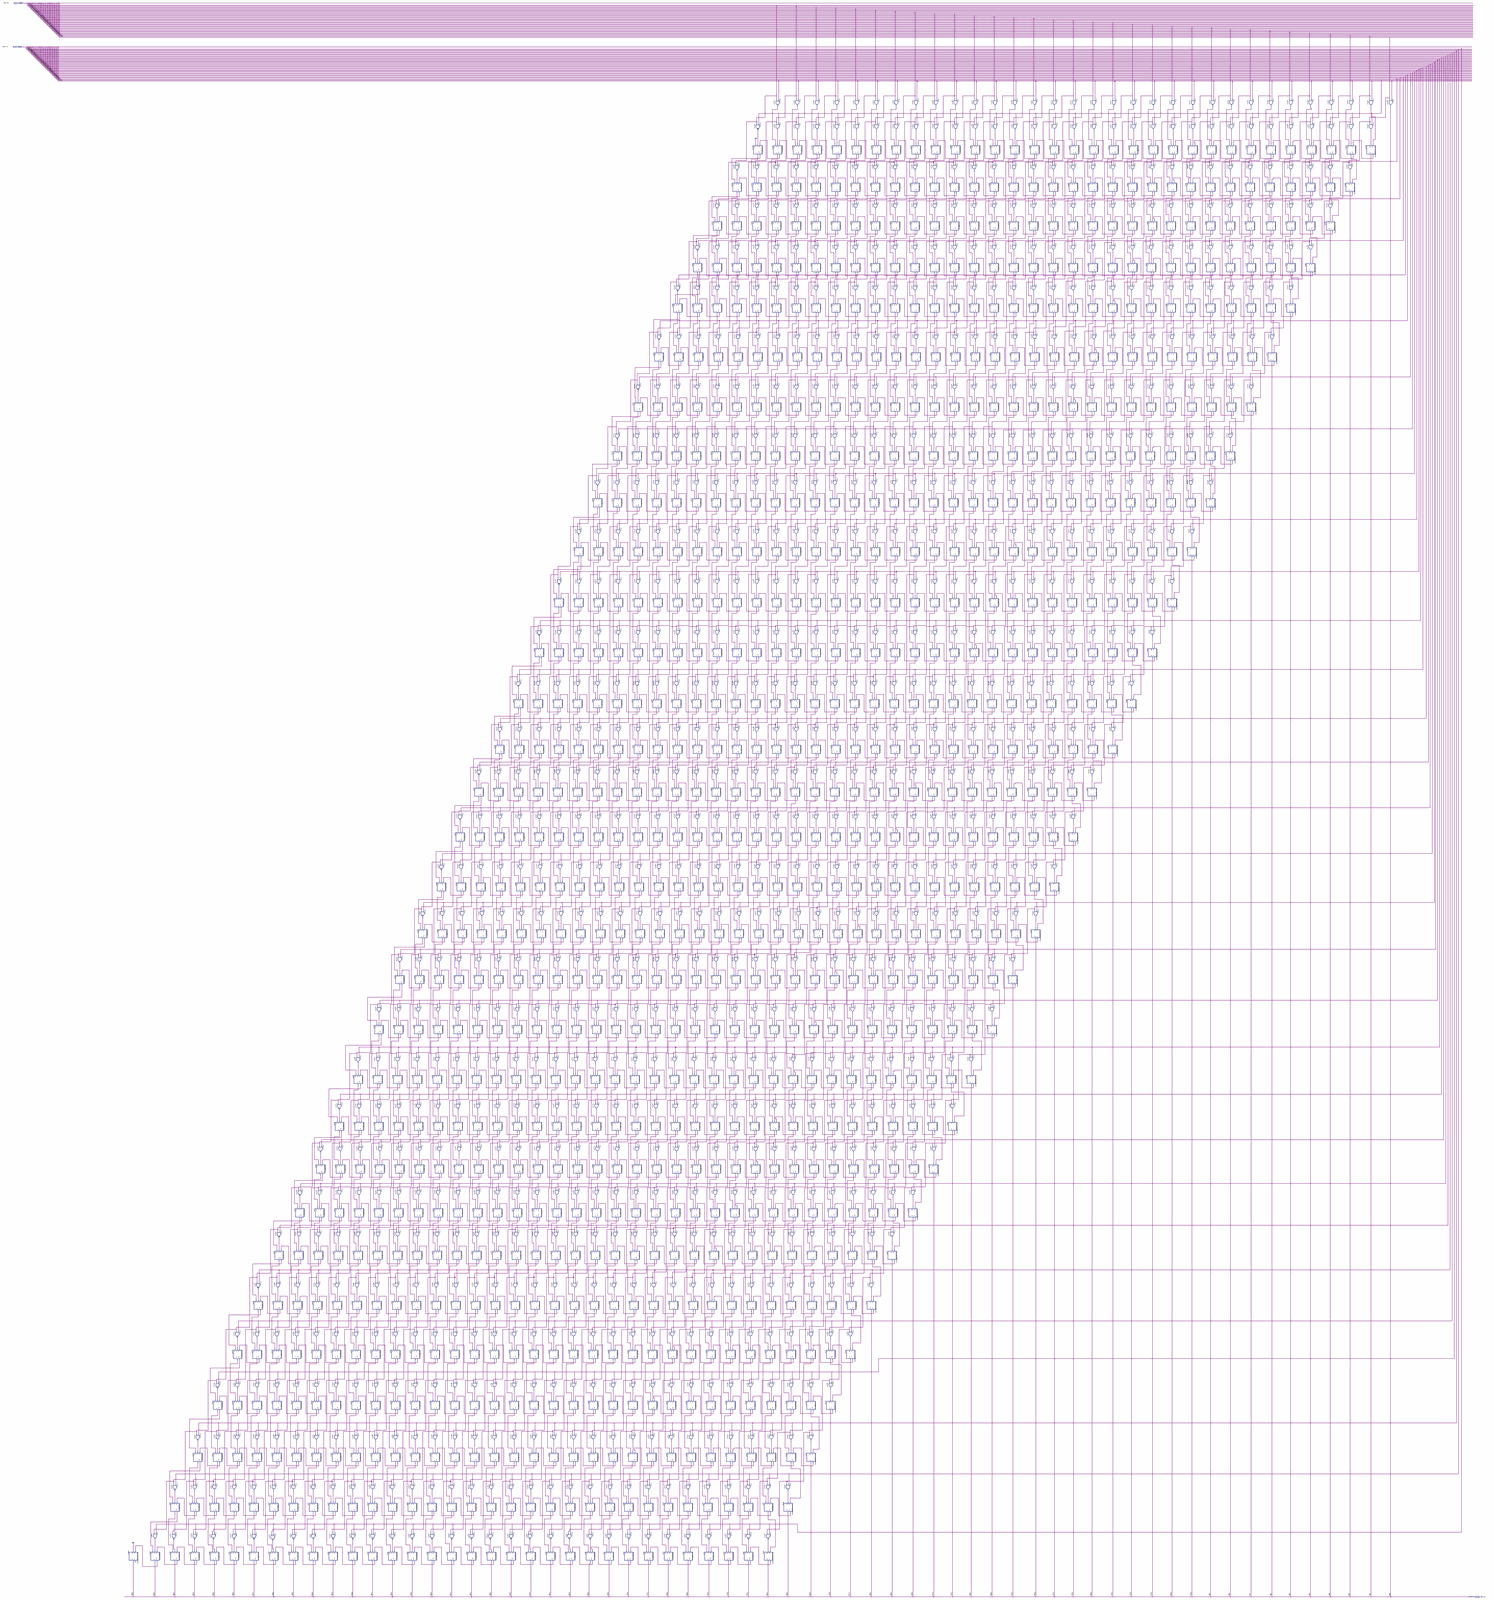
[diagram p0: schematic sheet, whole]
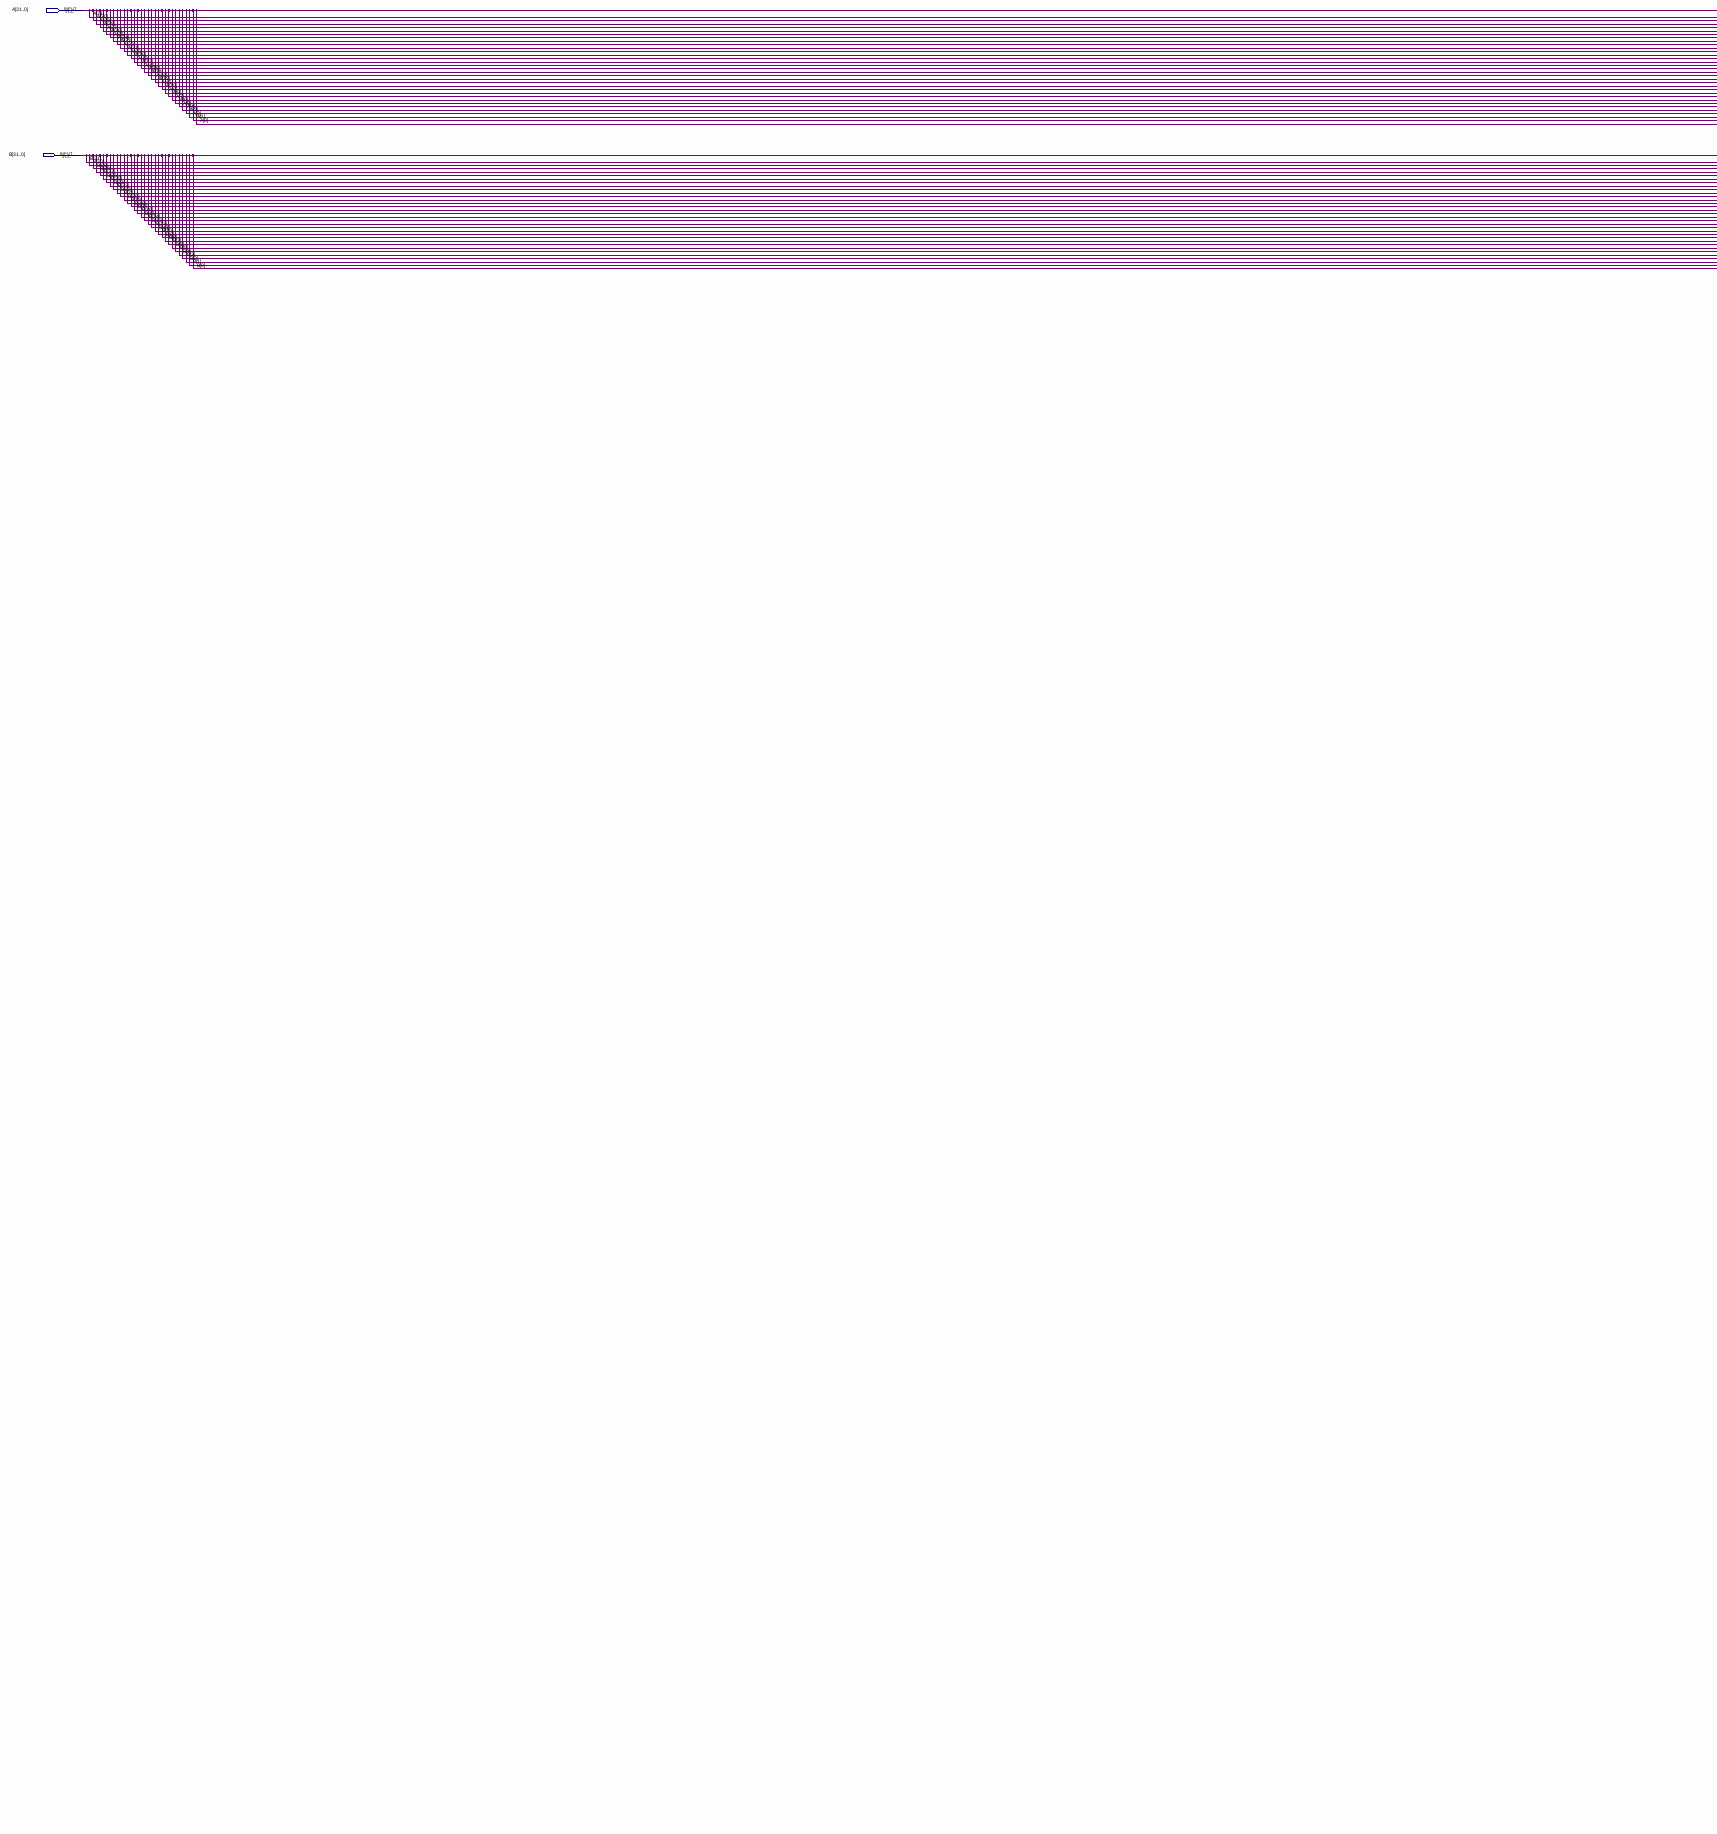
[diagram p1: schematic sheet, upper left part]
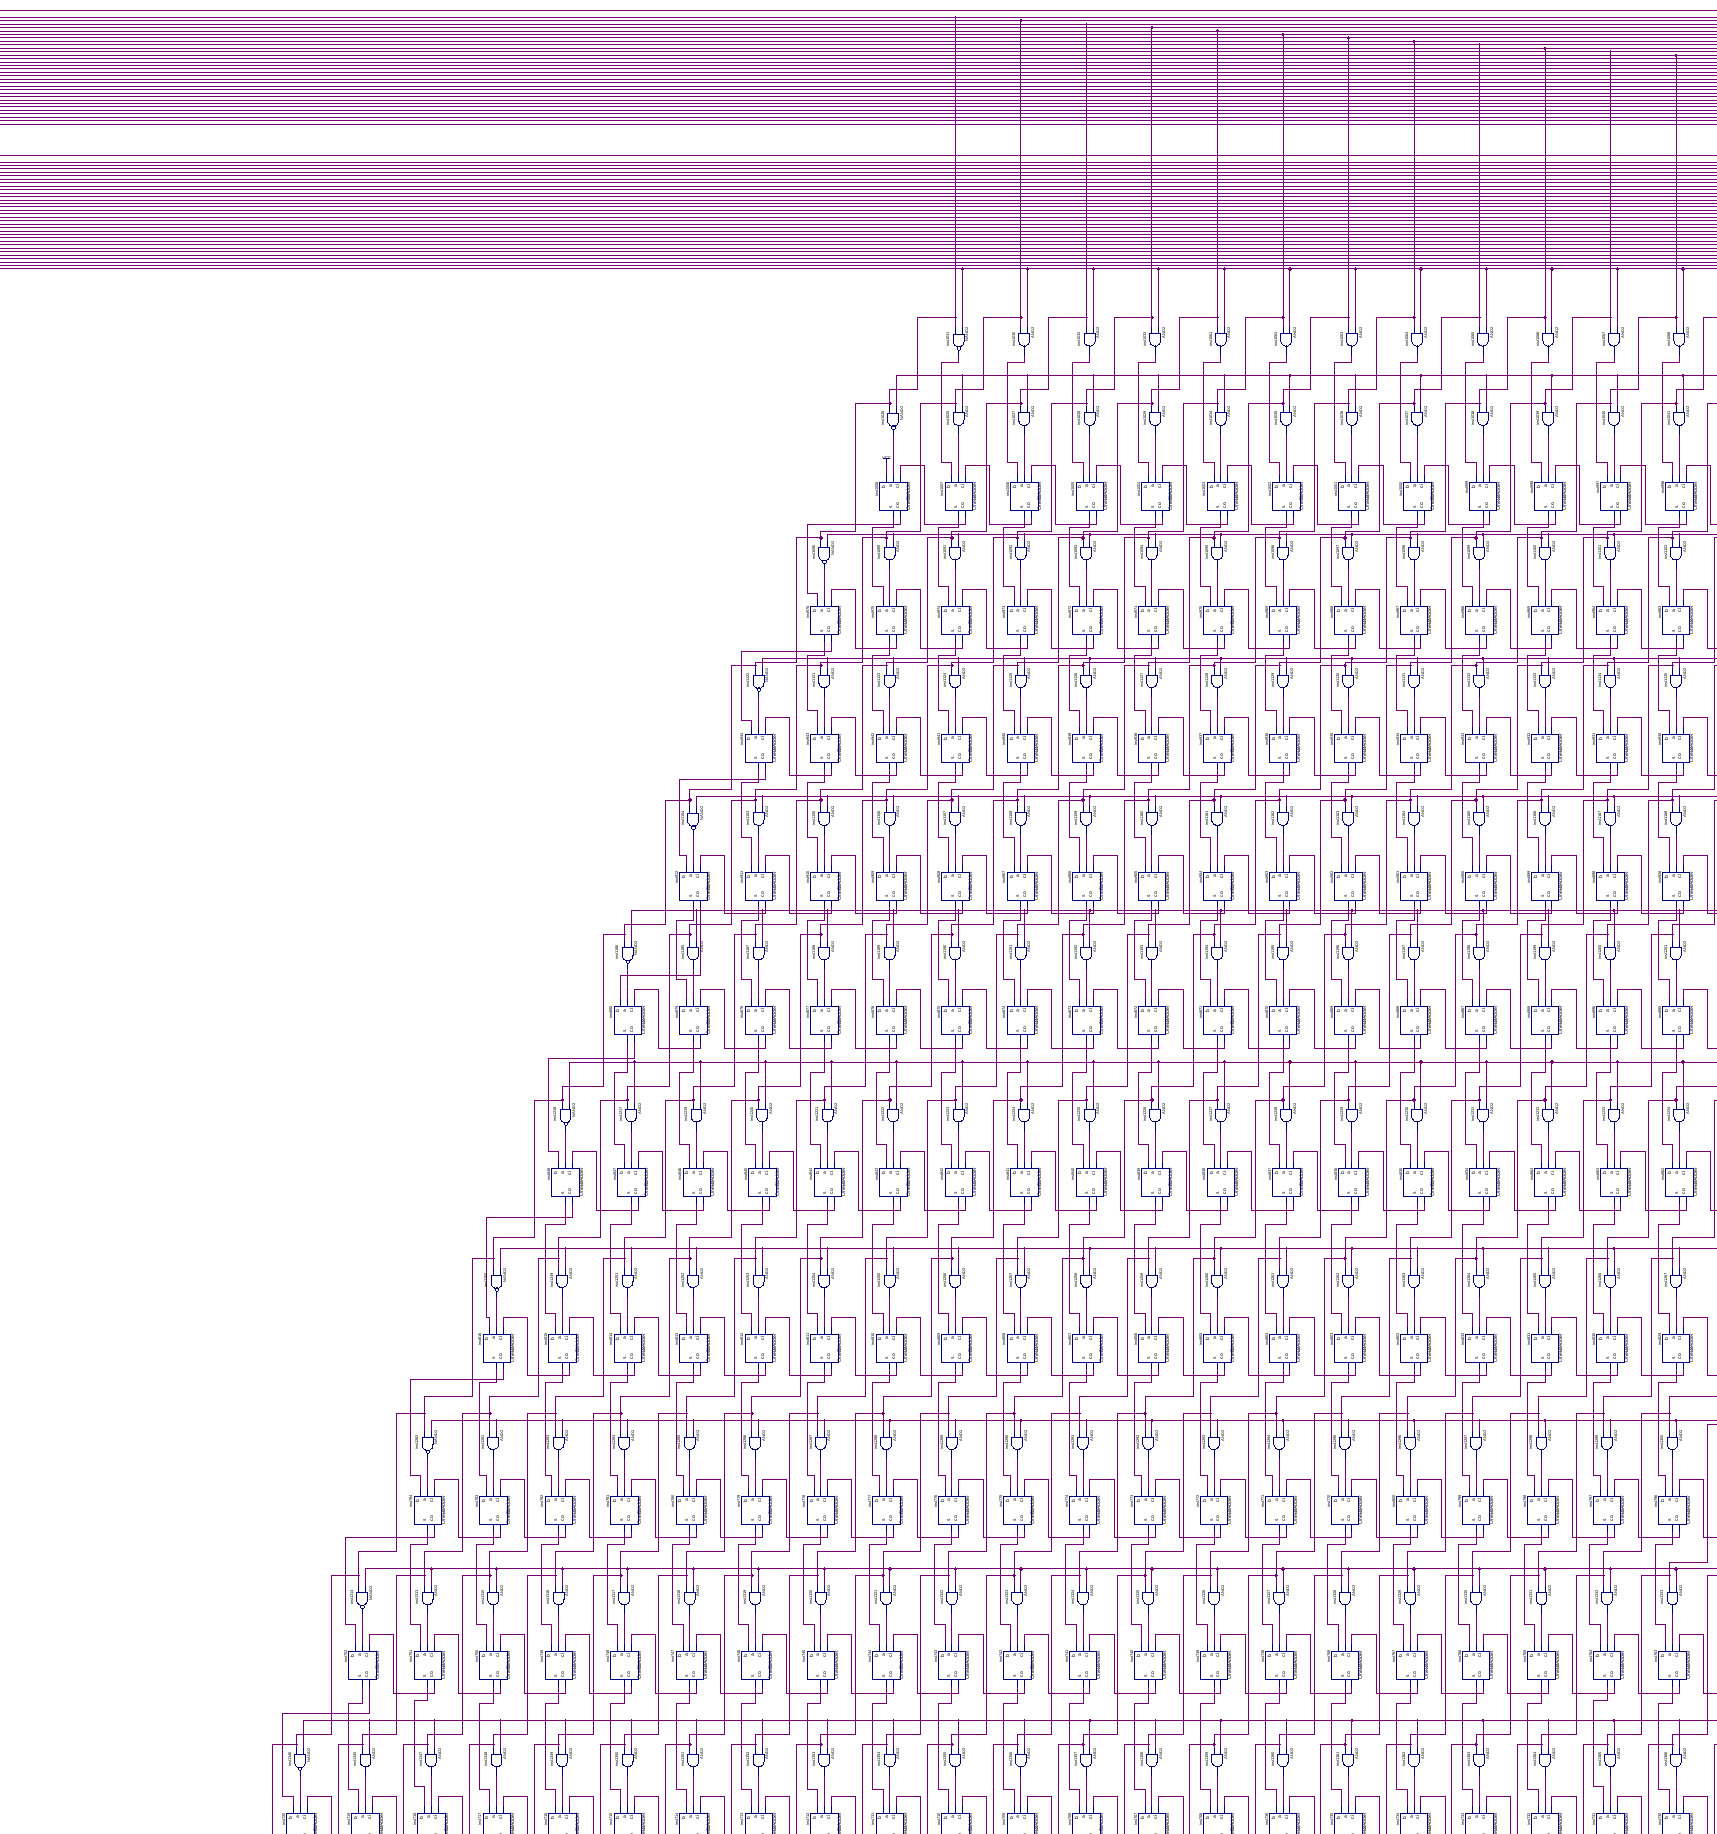
[diagram p2: schematic sheet, upper centre part]
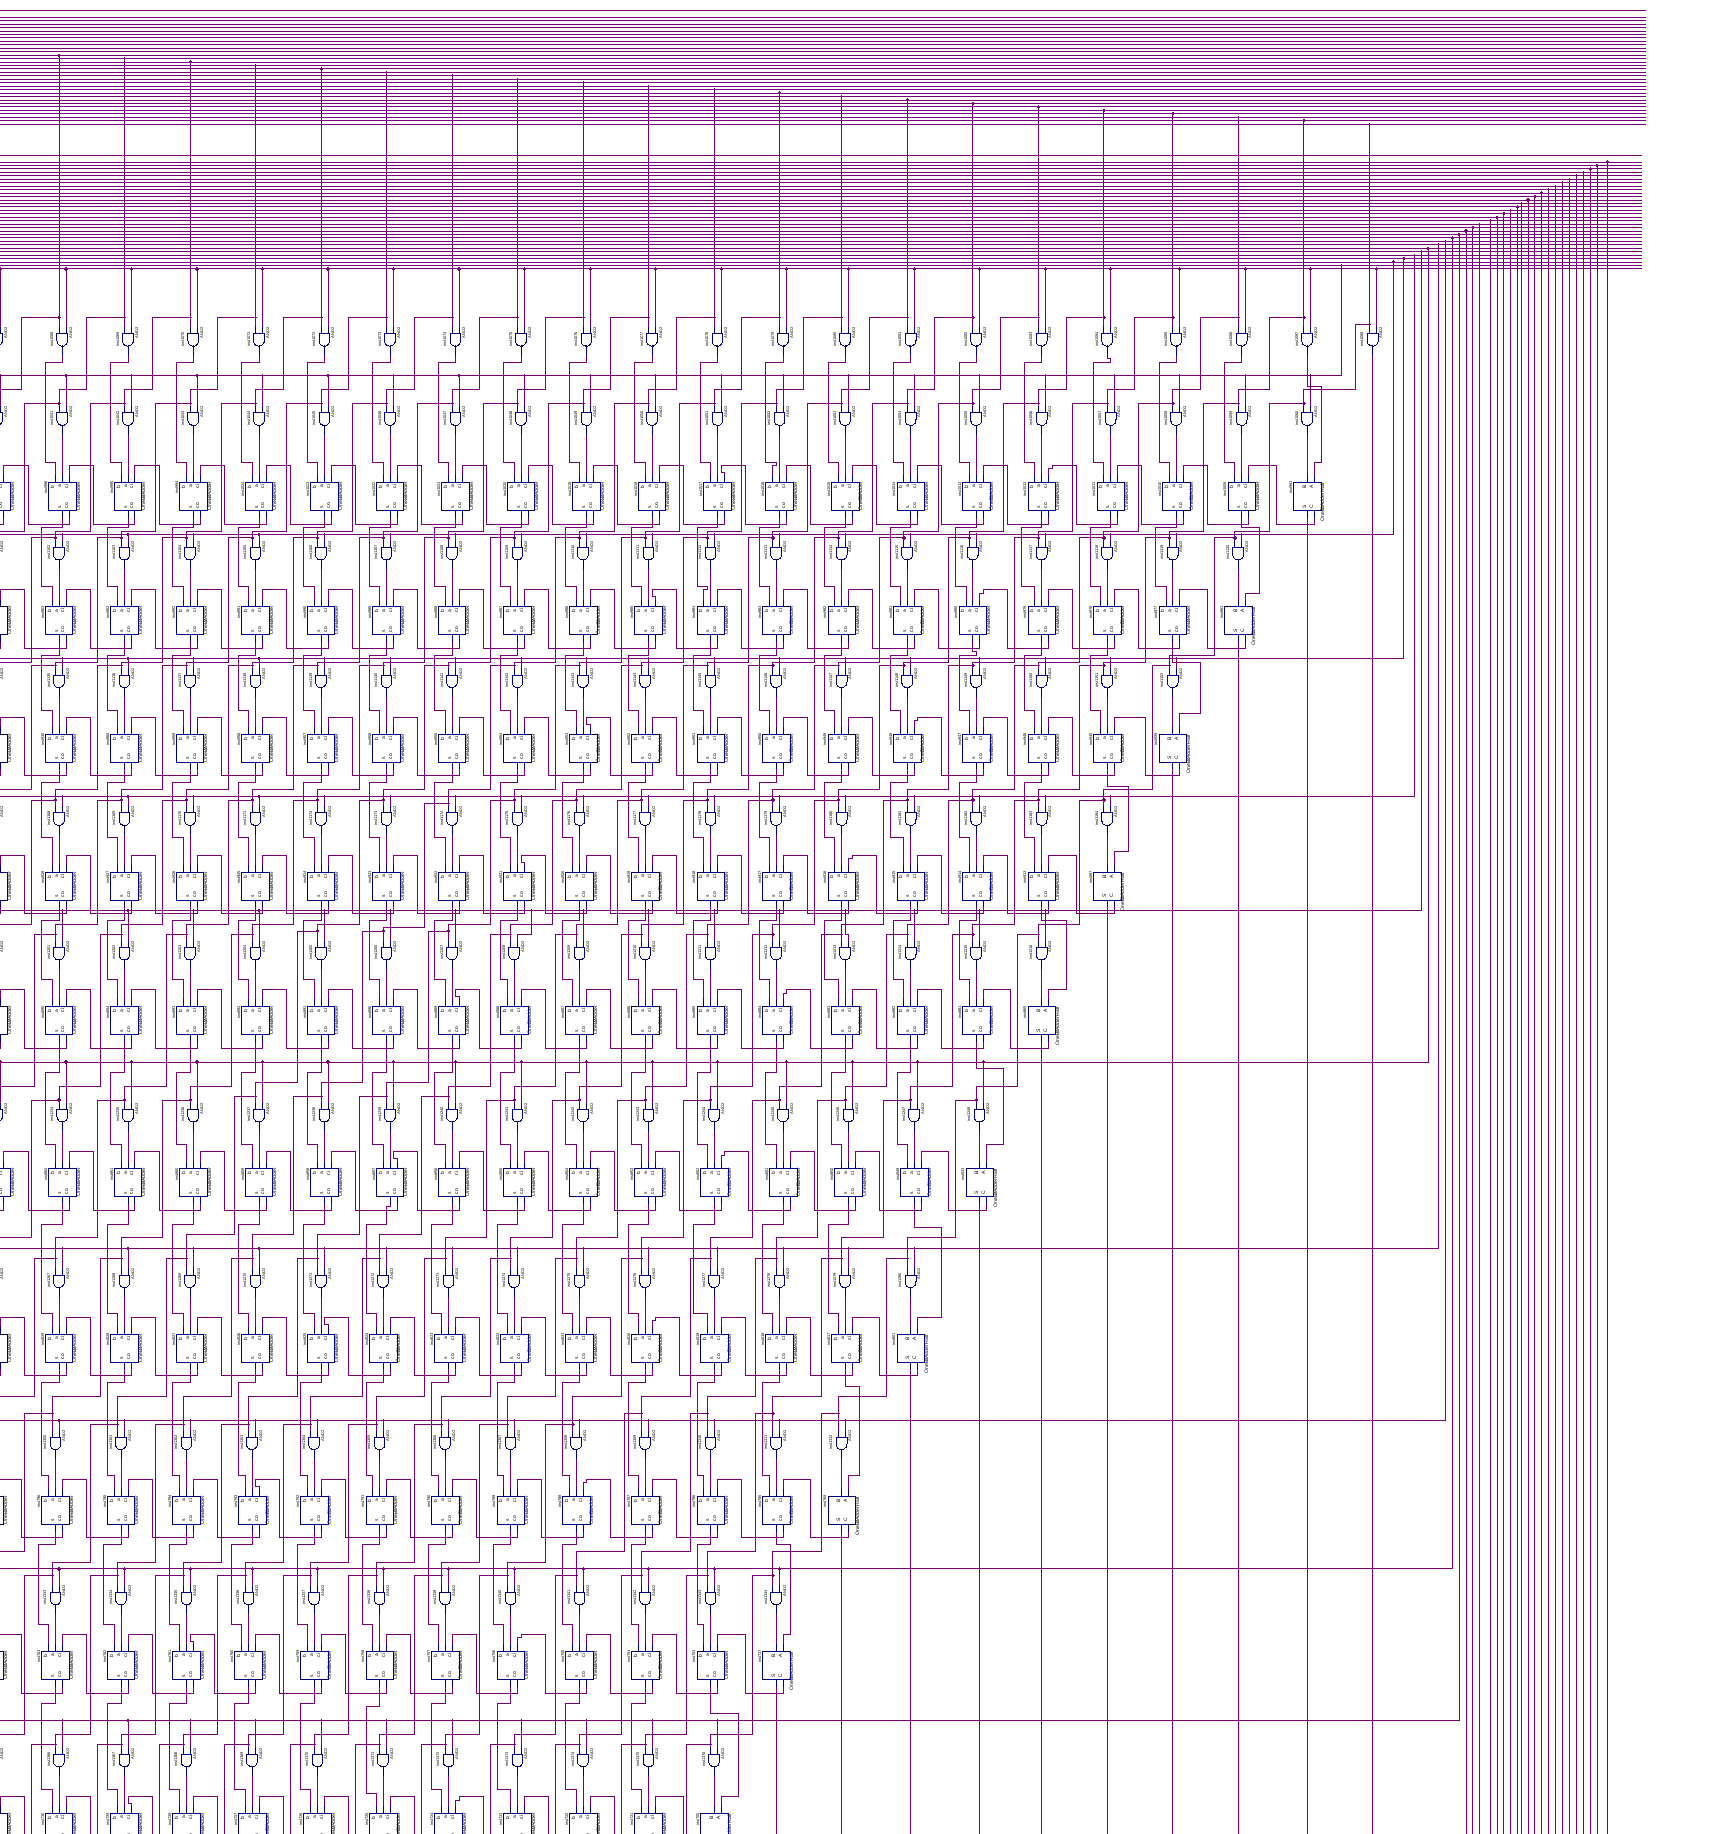
[diagram p3: schematic sheet, upper right part]
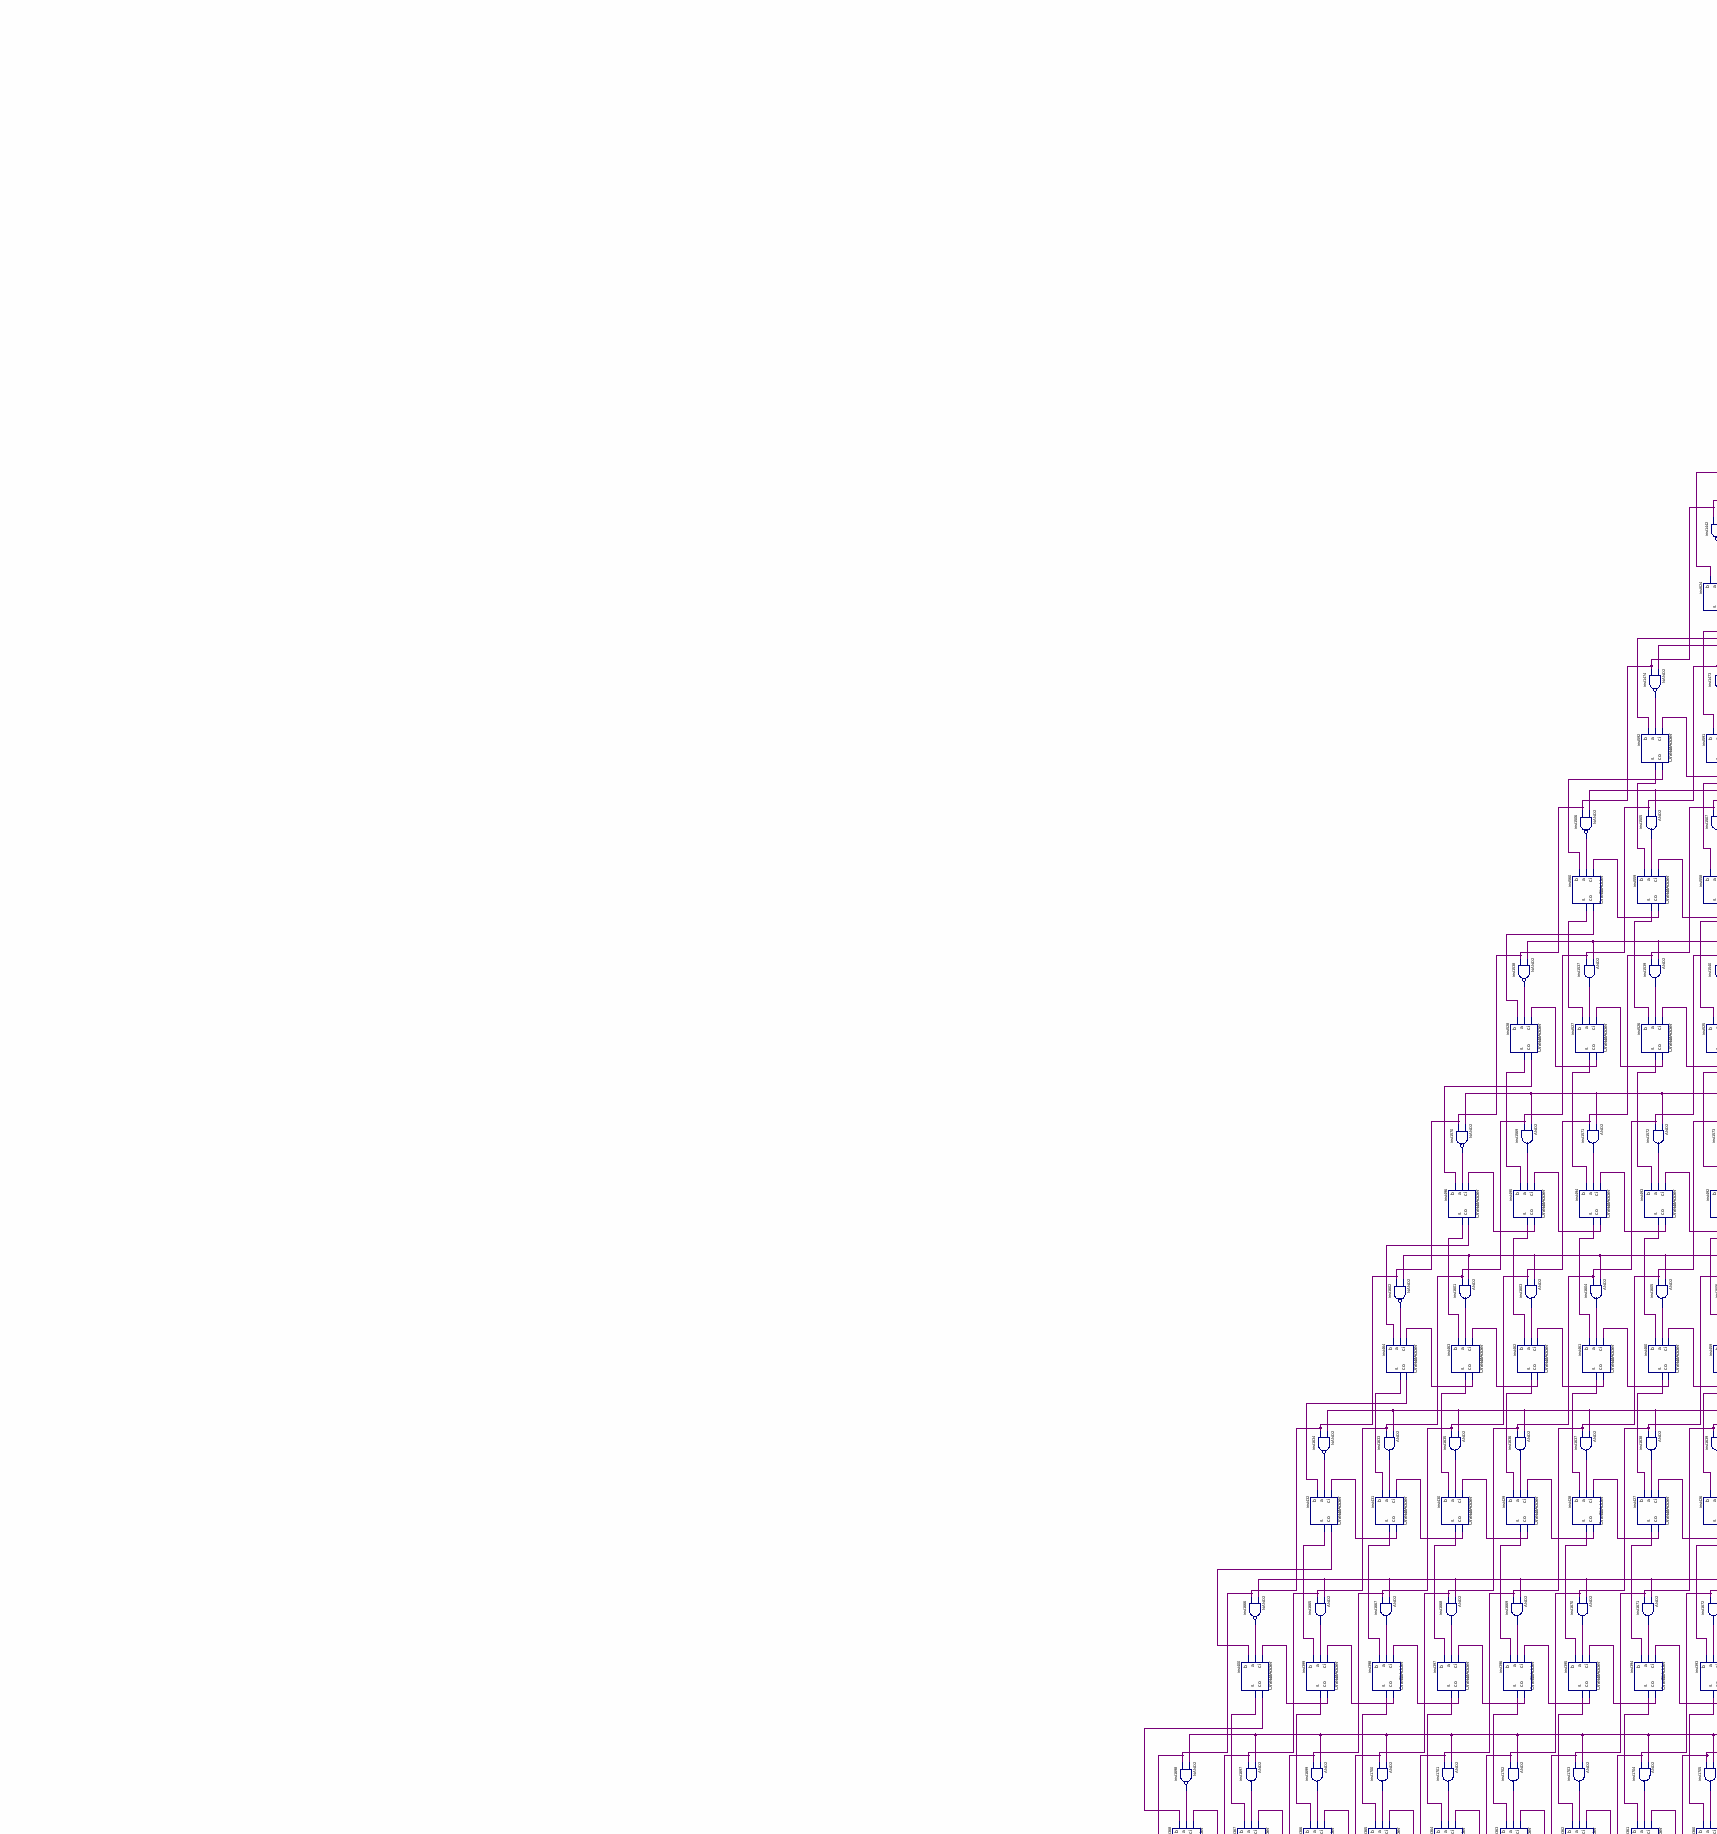
[diagram p4: schematic sheet, middle left part]
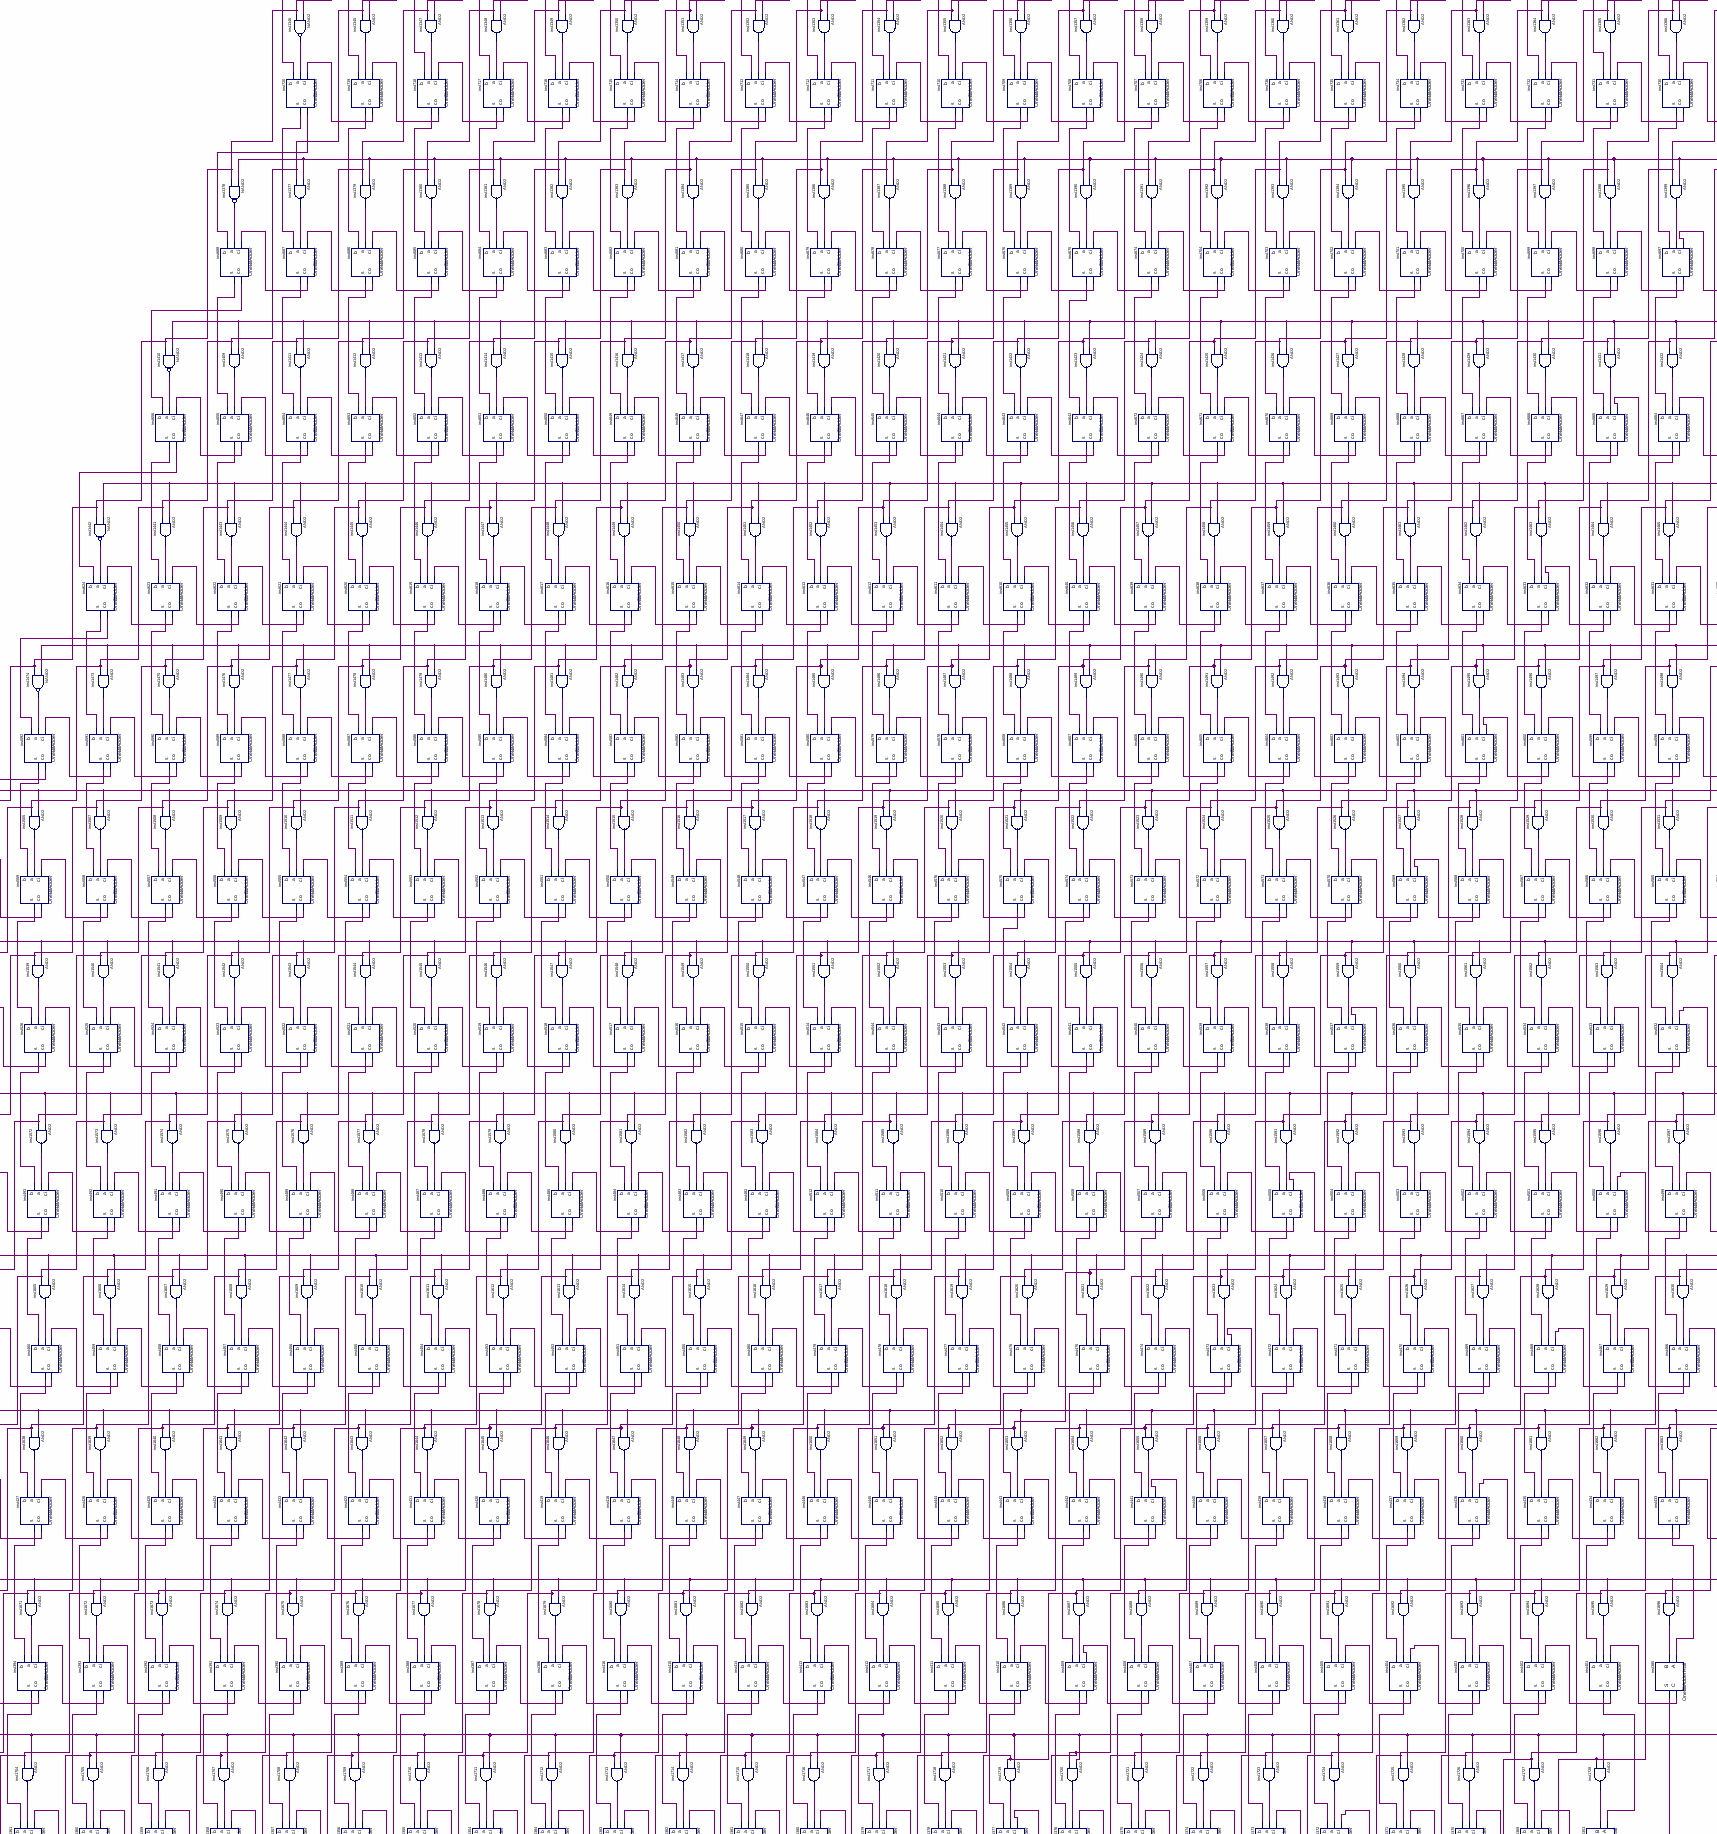
[diagram p5: schematic sheet, middle centre part]
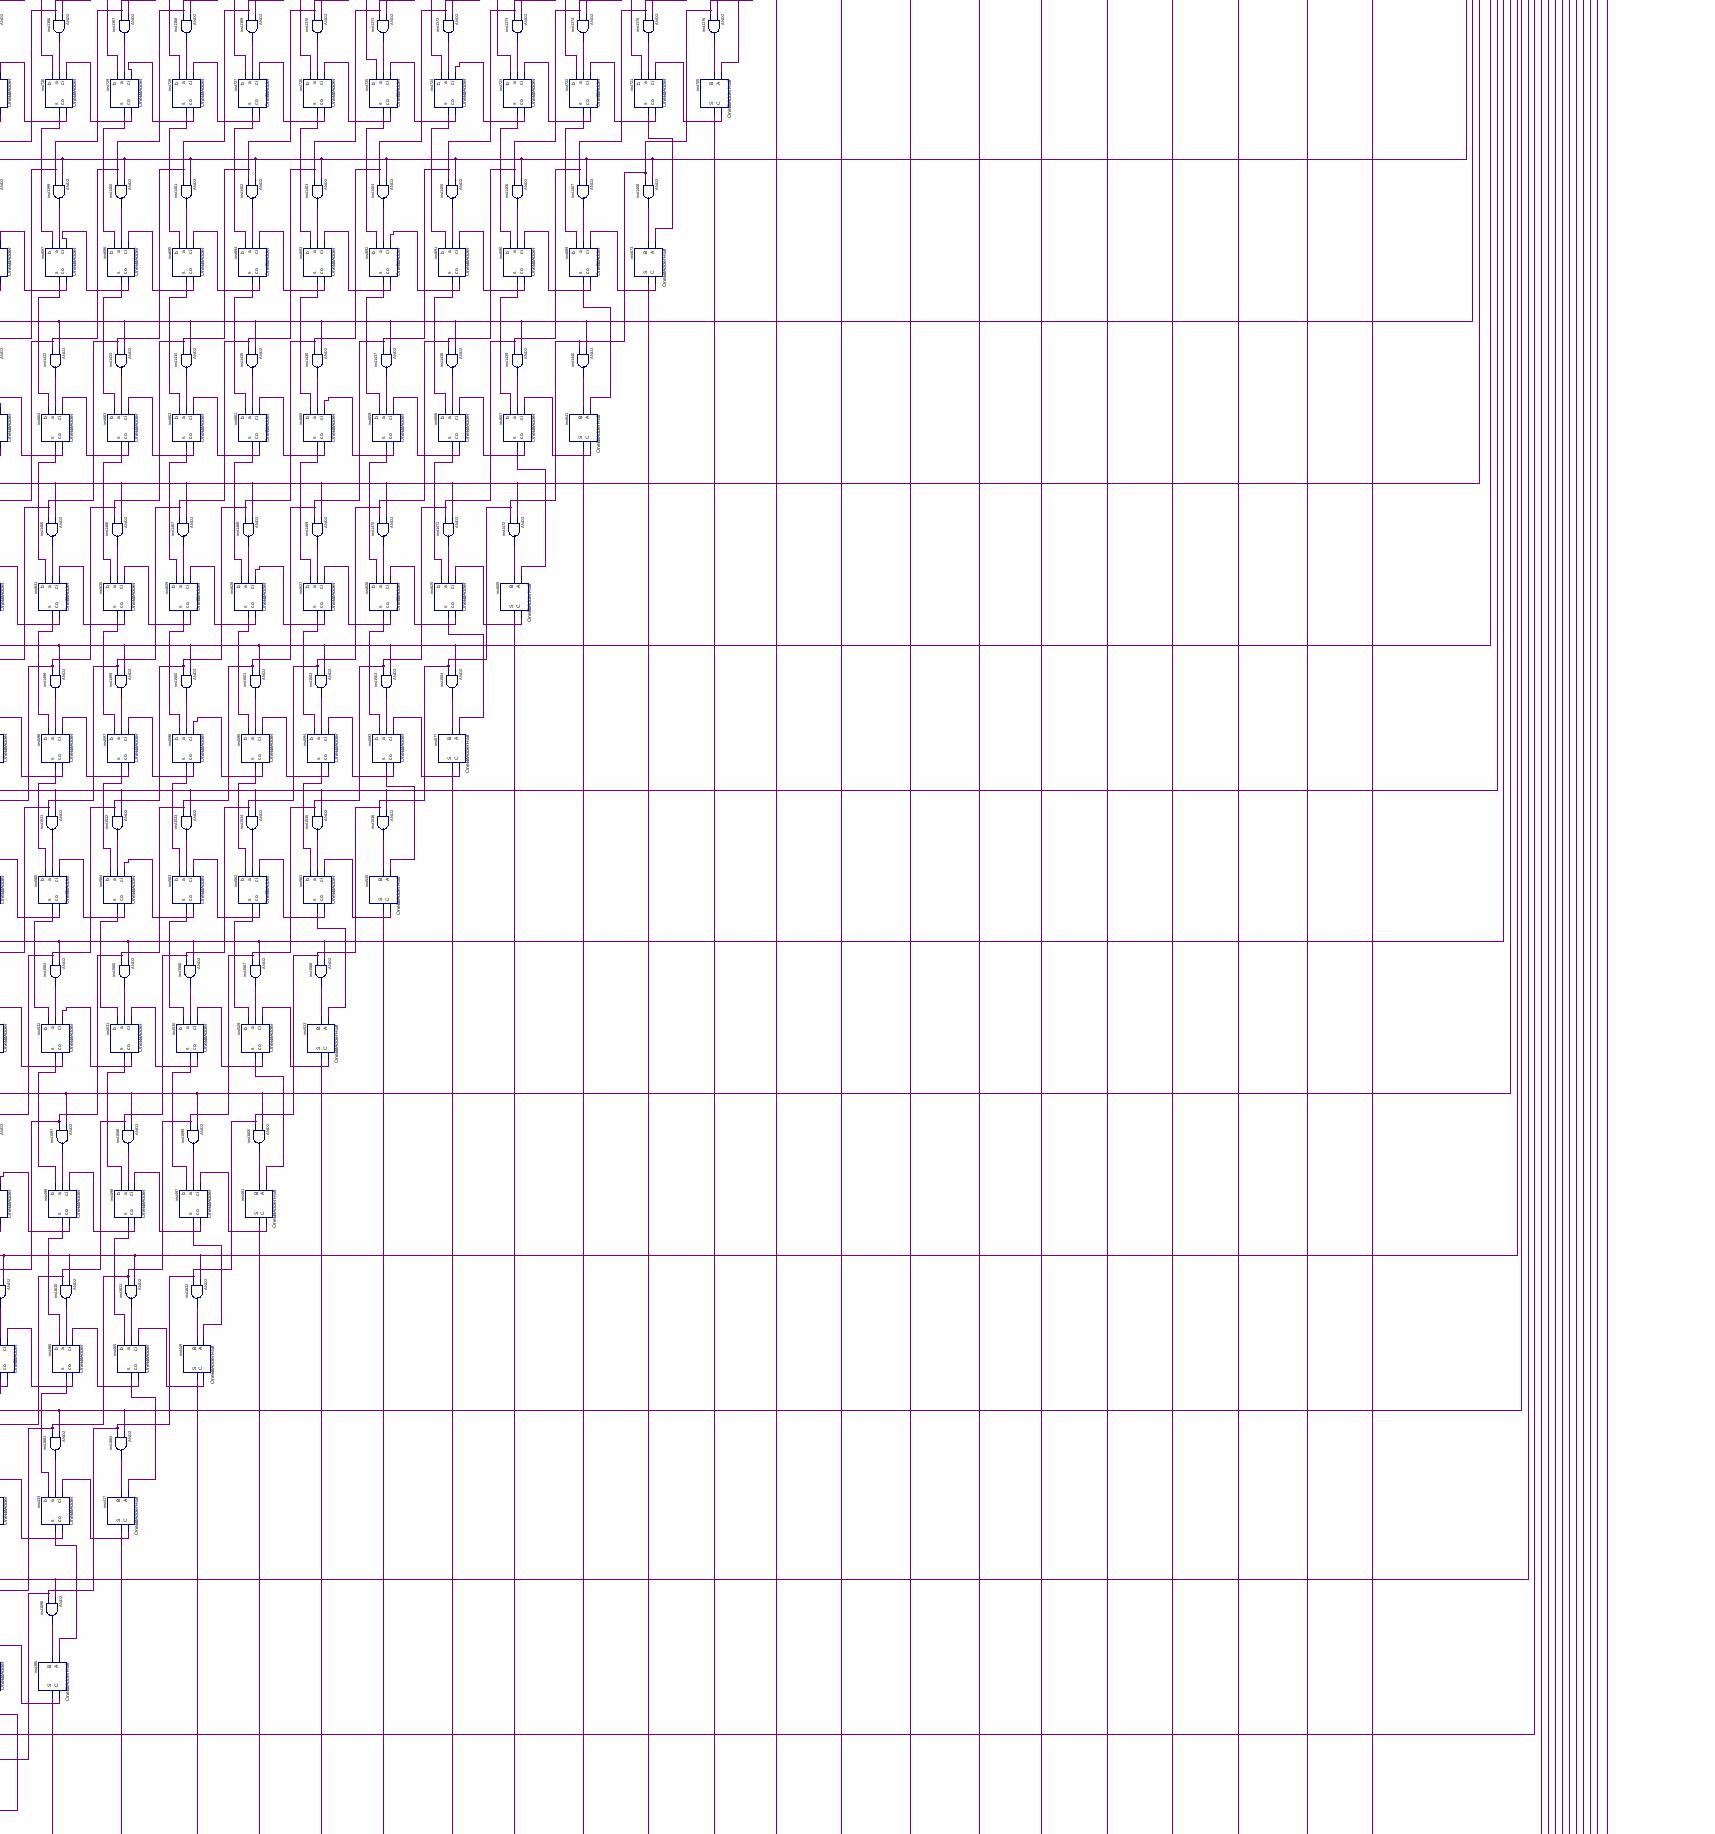
[diagram p6: schematic sheet, middle right part]
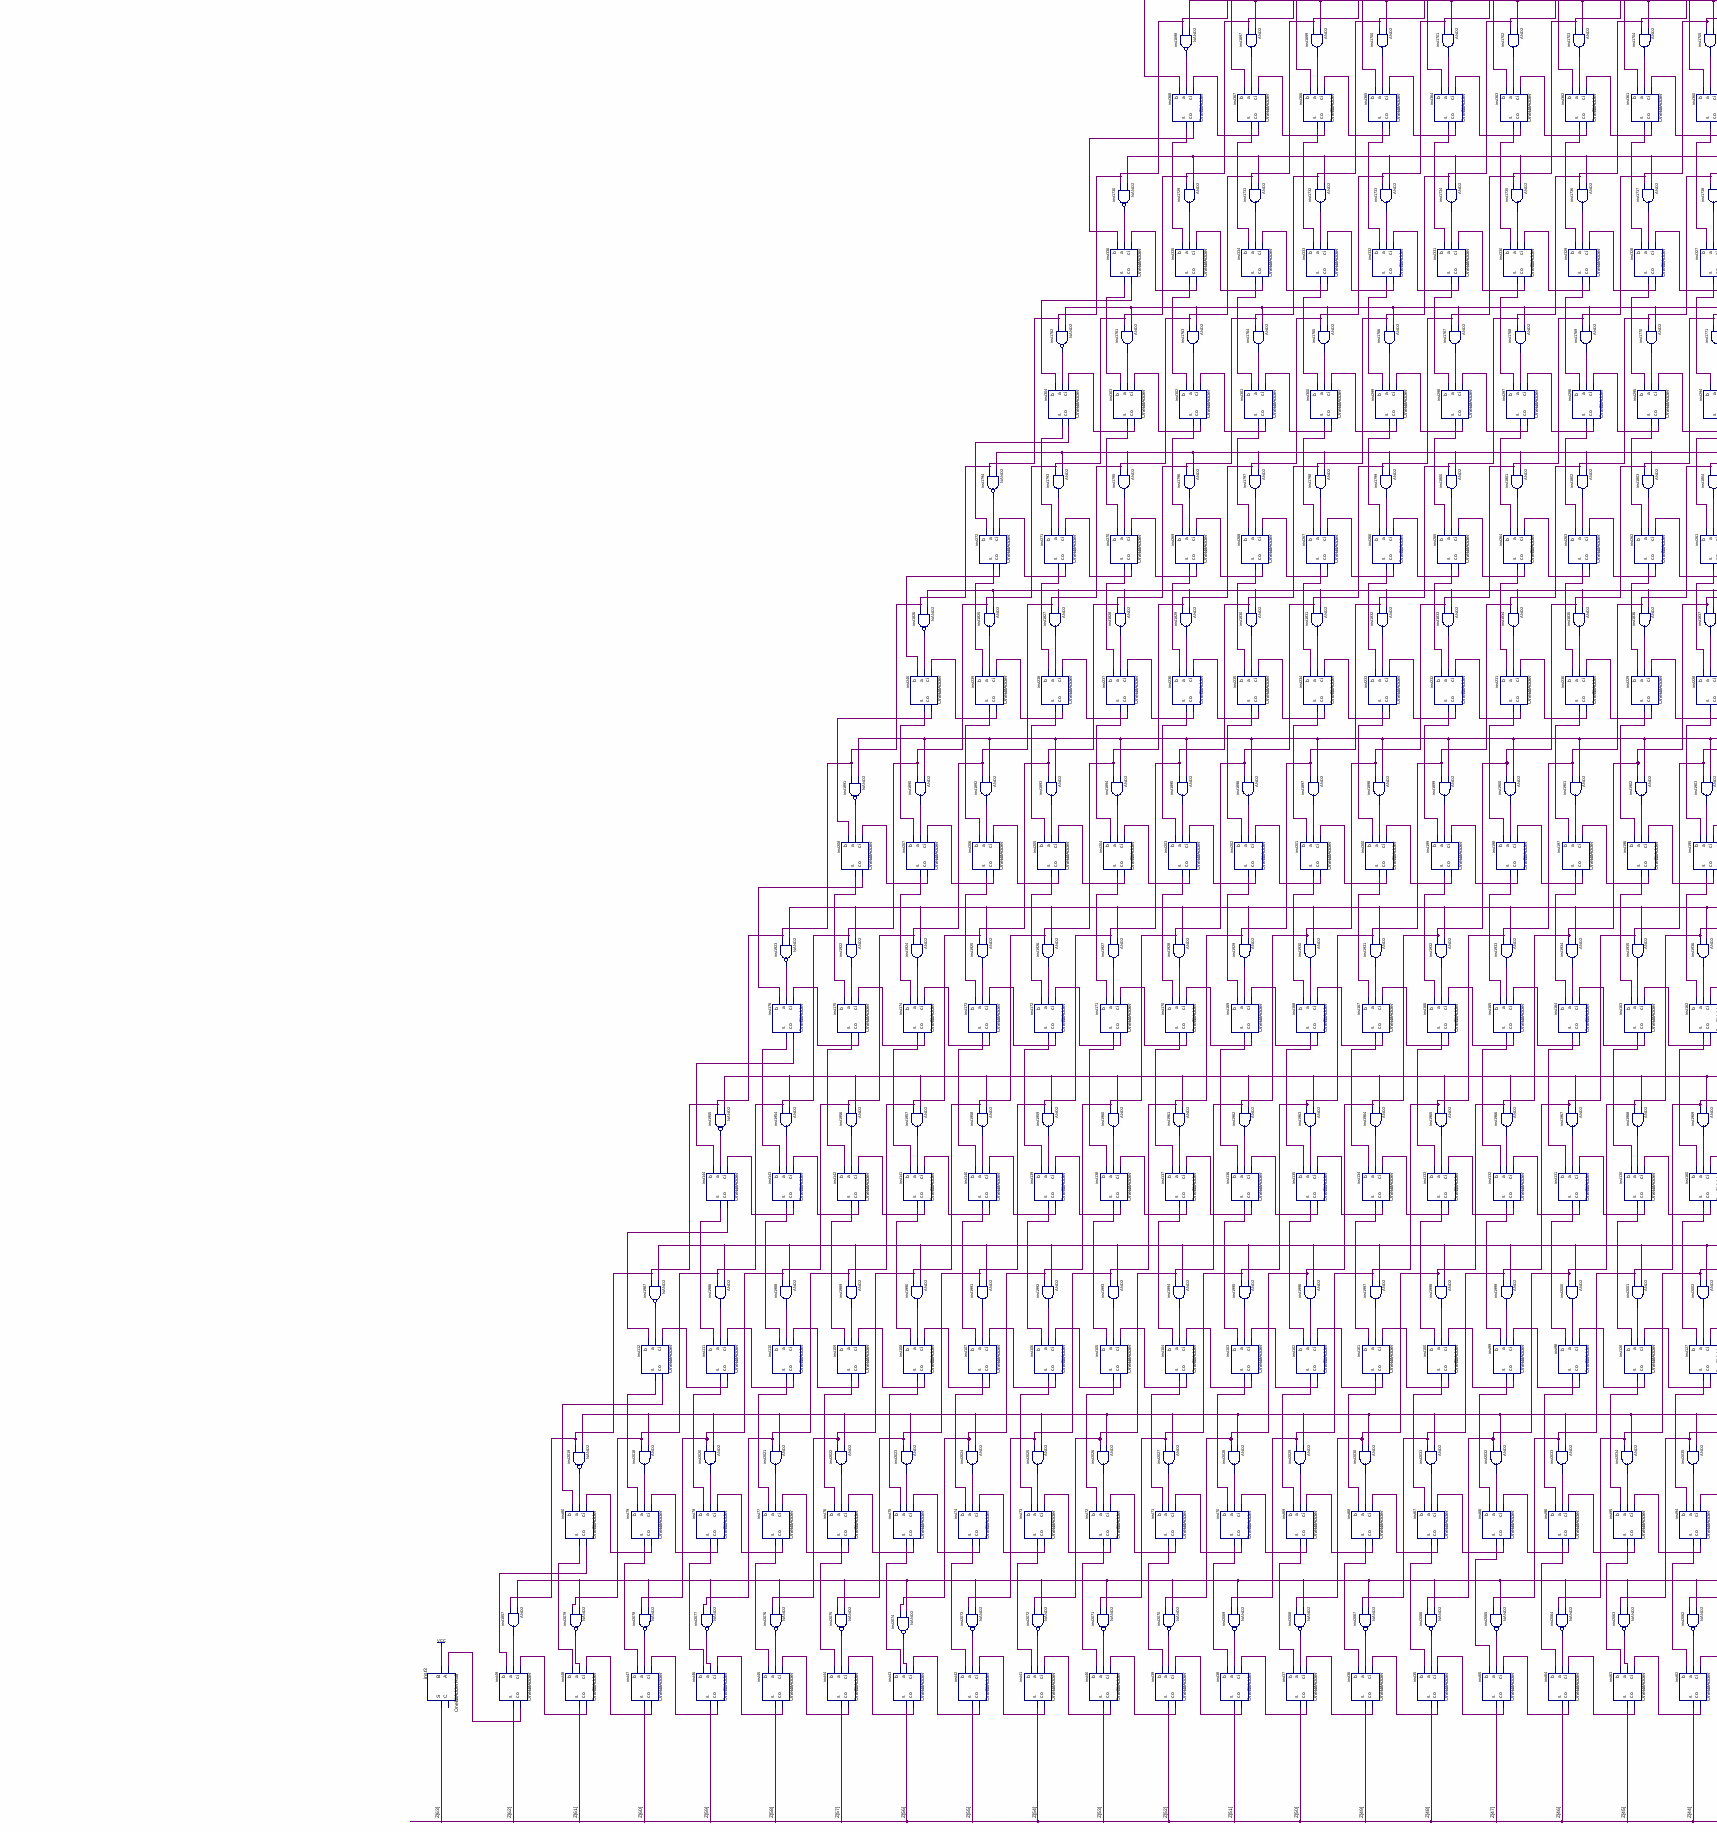
[diagram p7: schematic sheet, lower left part]
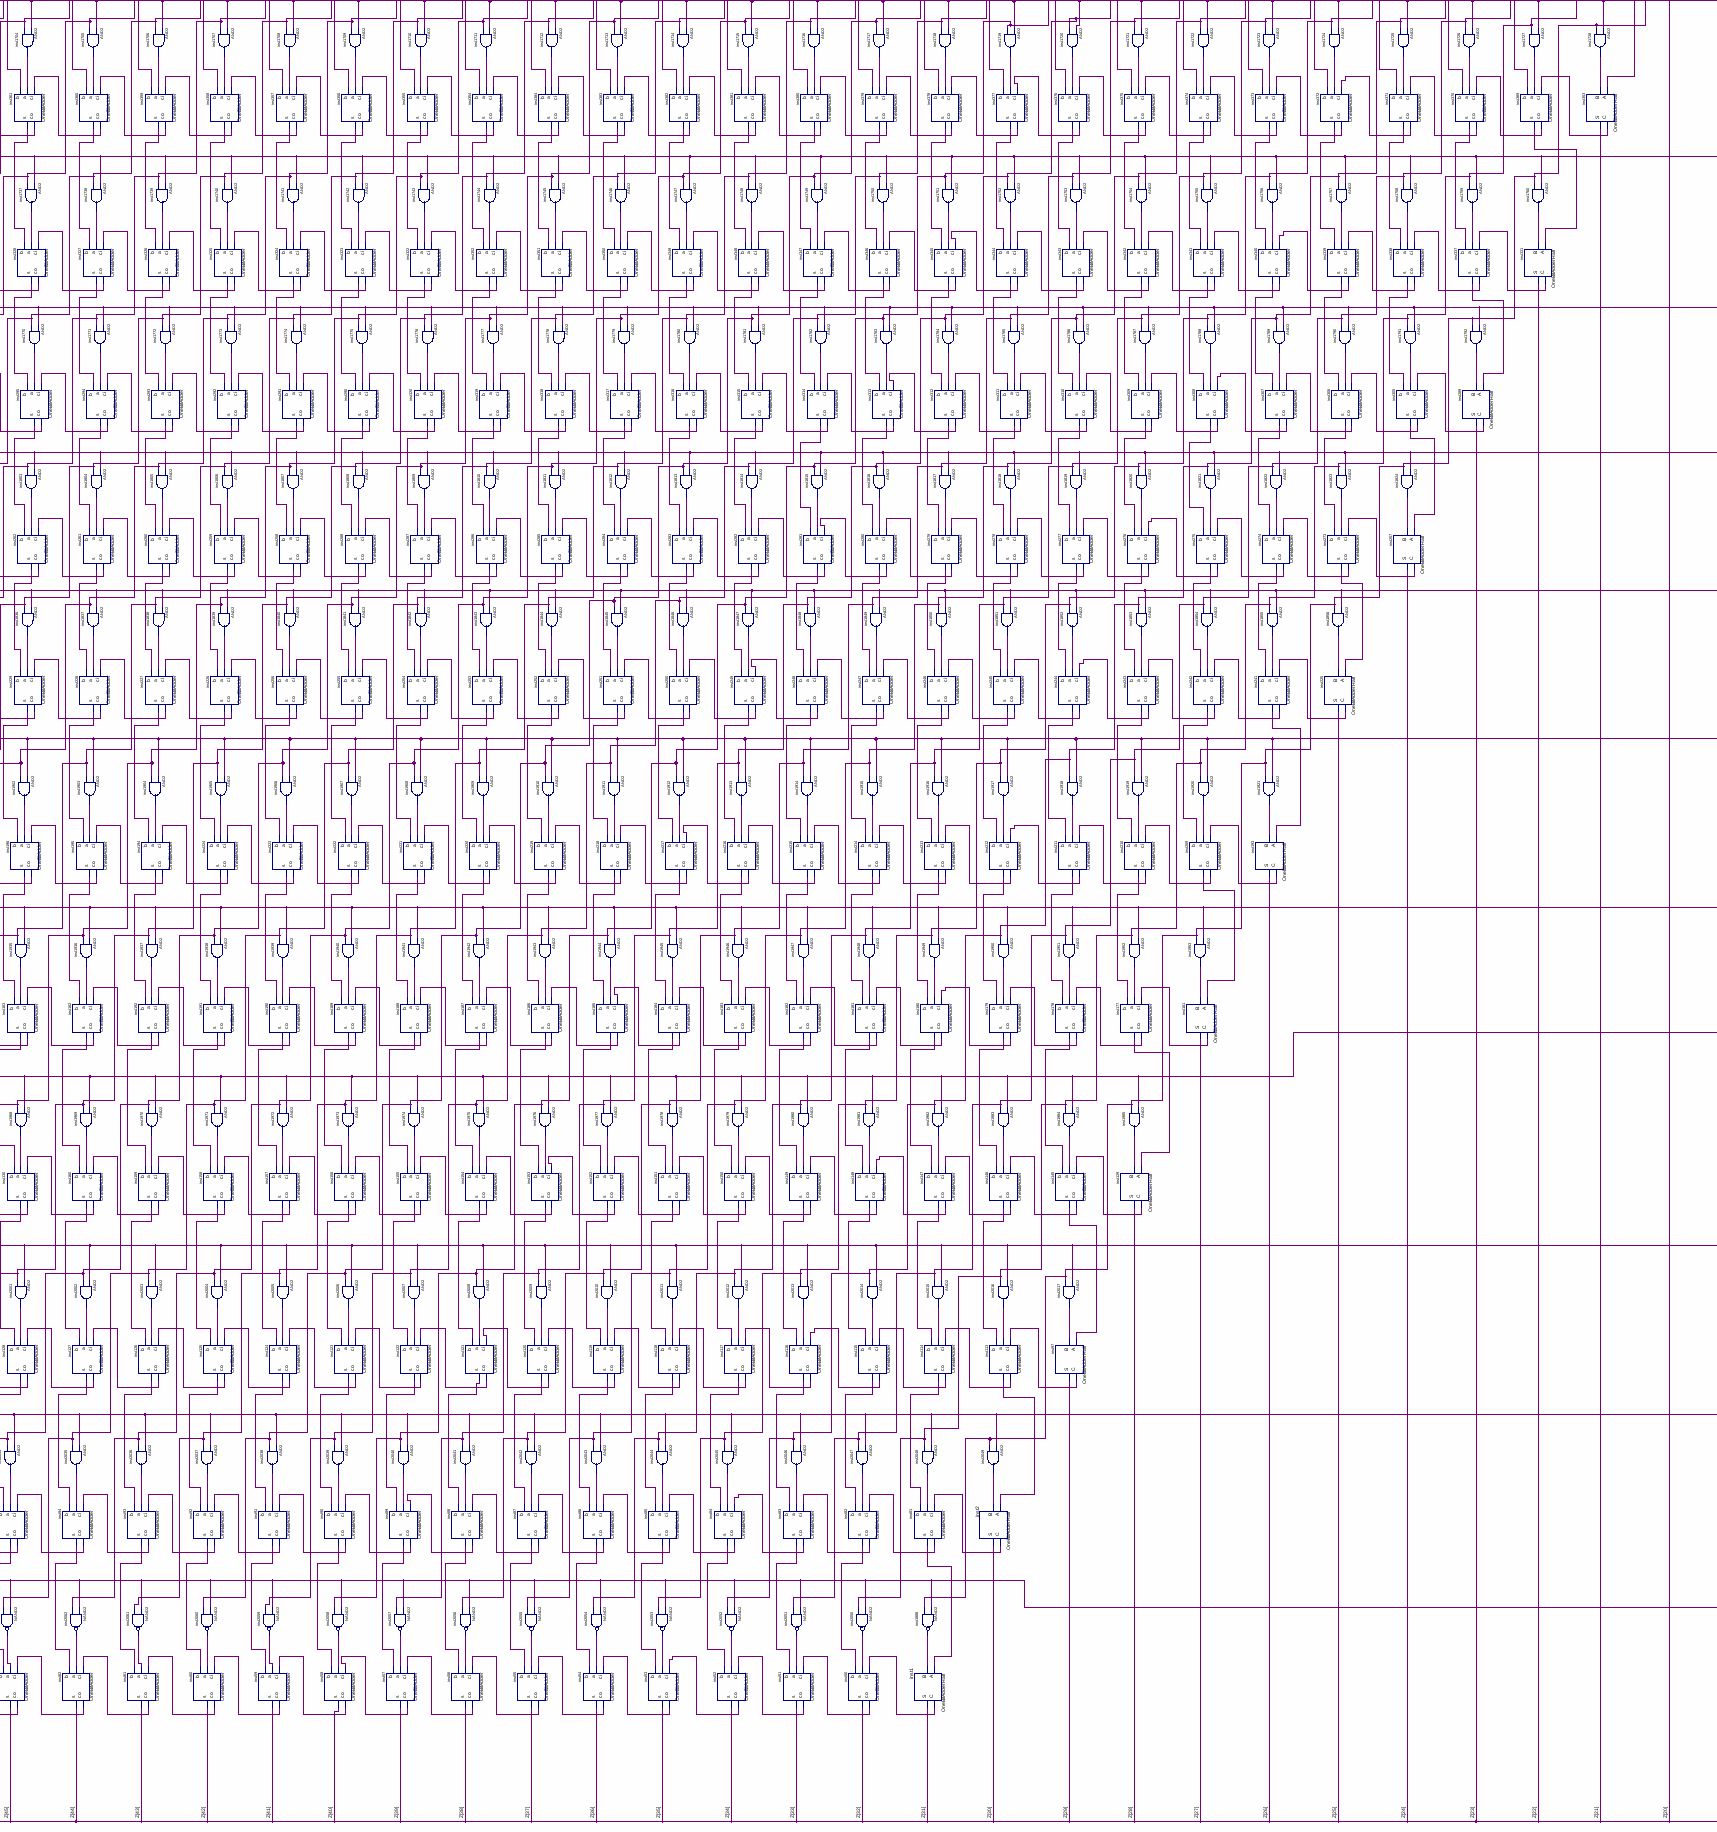
[diagram p8: schematic sheet, lower centre part]
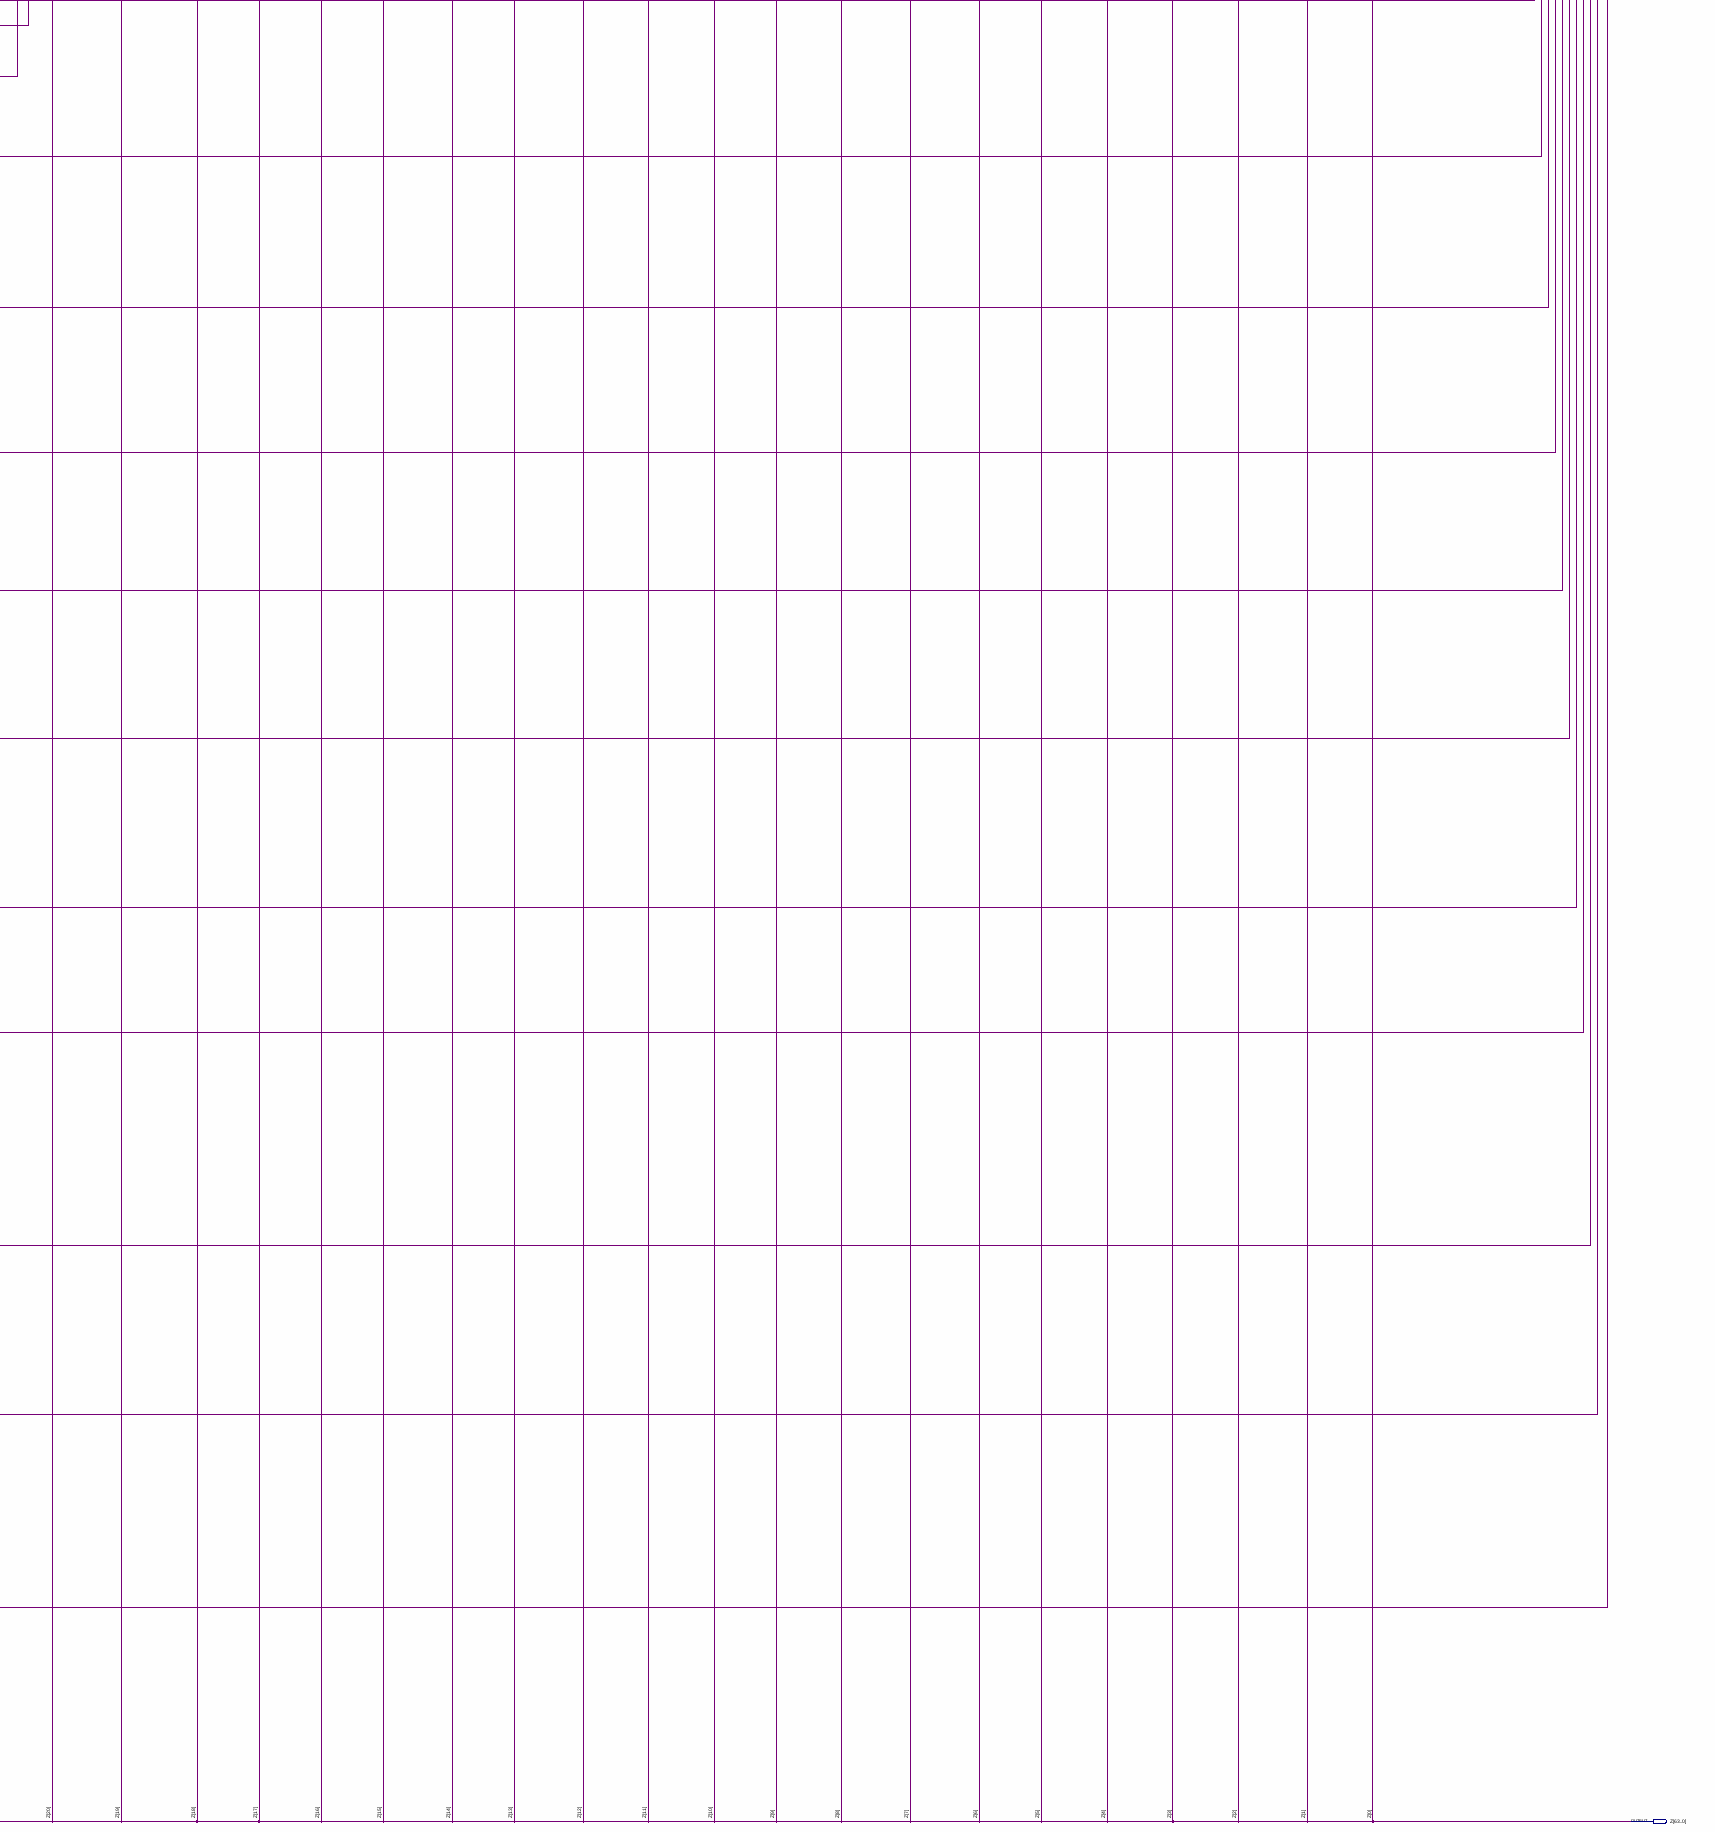
[diagram p9: schematic sheet, lower right part]
// Quartus schematic Multiplier_32.bdf as structural Verilog: 2017 symbols, 3 pins
module Multiplier_32 (
  input  [31:0] A,
  input  [31:0] B,
  output [63:0] Z
);

  wire inst1_c, inst2_c, inst35_co, inst36_co, inst37_co, inst38_co, inst39_co, inst40_co, inst41_co,
       inst42_co, inst43_co, inst44_co, inst45_co, inst46_co, inst47_co, inst48_co, inst49_co, inst50_co,
       inst51_co, inst52_co, inst53_co, inst54_co, inst55_co, inst56_co, inst57_co, inst58_co, inst59_co,
       inst60_co, inst61_co, inst62_co, inst63_co, inst64_co, inst65_co, inst66_co, inst66_s, inst67_co,
       inst67_s, inst68_co, inst68_s, inst69_co, inst69_s, inst70_co, inst70_s, inst71_co, inst71_s,
       inst72_co, inst72_s, inst73_co, inst73_s, inst74_co, inst74_s, inst75_co, inst75_s, inst76_co,
       inst76_s, inst77_co, inst77_s, inst78_co, inst78_s, inst79_co, inst79_s, inst80_co, inst80_s,
       inst81_co, inst81_s, inst82_co, inst82_s, inst83_co, inst83_s, inst84_co, inst84_s, inst85_co,
       inst85_s, inst86_co, inst86_s, inst87_co, inst87_s, inst88_co, inst88_s, inst89_co, inst89_s,
       inst90_co, inst90_s, inst91_co, inst91_s, inst92_co, inst92_s, inst93_co, inst93_s, inst94_co,
       inst94_s, inst95_co, inst95_s, inst96_co, inst96_s, inst97_c, inst98_co, inst98_s, inst99_co,
       inst99_s, inst100_co, inst100_s, inst101_co, inst101_s, inst102_co, inst102_s, inst103_co, inst103_s,
       inst104_co, inst104_s, inst105_co, inst105_s, inst106_co, inst106_s, inst107_co, inst107_s,
       inst108_co, inst108_s, inst109_co, inst109_s, inst110_co, inst110_s, inst111_co, inst111_s,
       inst112_co, inst112_s, inst113_co, inst113_s, inst114_co, inst114_s, inst115_co, inst115_s,
       inst116_co, inst116_s, inst117_co, inst117_s, inst118_co, inst118_s, inst119_co, inst119_s,
       inst120_co, inst120_s, inst121_co, inst121_s, inst122_co, inst122_s, inst123_co, inst123_s,
       inst124_co, inst124_s, inst125_co, inst125_s, inst126_co, inst126_s, inst127_co, inst127_s,
       inst128_co, inst128_s, inst129_c, inst130_co, inst130_s, inst131_co, inst131_s, inst132_co, inst132_s,
       inst133_co, inst133_s, inst134_co, inst134_s, inst135_co, inst135_s, inst136_co, inst136_s,
       inst137_co, inst137_s, inst138_co, inst138_s, inst139_co, inst139_s, inst140_co, inst140_s,
       inst141_co, inst141_s, inst142_co, inst142_s, inst143_co, inst143_s, inst144_co, inst144_s,
       inst145_co, inst145_s, inst146_co, inst146_s, inst147_co, inst147_s, inst148_co, inst148_s,
       inst149_co, inst149_s, inst150_co, inst150_s, inst151_co, inst151_s, inst152_co, inst152_s,
       inst153_co, inst153_s, inst154_co, inst154_s, inst155_co, inst155_s, inst156_co, inst156_s,
       inst157_co, inst157_s, inst158_co, inst158_s, inst159_co, inst159_s, inst160_co, inst160_s, inst161_c,
       inst162_co, inst162_s, inst163_co, inst163_s, inst164_co, inst164_s, inst165_co, inst165_s,
       inst166_co, inst166_s, inst167_co, inst167_s, inst168_co, inst168_s, inst169_co, inst169_s,
       inst170_co, inst170_s, inst171_co, inst171_s, inst172_co, inst172_s, inst173_co, inst173_s,
       inst174_co, inst174_s, inst175_co, inst175_s, inst176_co, inst176_s, inst177_co, inst177_s,
       inst178_co, inst178_s, inst179_co, inst179_s, inst180_co, inst180_s, inst181_co, inst181_s,
       inst182_co, inst182_s, inst183_co, inst183_s, inst184_co, inst184_s, inst185_co, inst185_s,
       inst186_co, inst186_s, inst187_co, inst187_s, inst188_co, inst188_s, inst189_co, inst189_s,
       inst190_co, inst190_s, inst191_co, inst191_s, inst192_co, inst192_s, inst193_c, inst194_co, inst194_s,
       inst195_co, inst195_s, inst196_co, inst196_s, inst197_co, inst197_s, inst198_co, inst198_s,
       inst199_co, inst199_s, inst200_co, inst200_s, inst201_co, inst201_s, inst202_co, inst202_s,
       inst203_co, inst203_s, inst204_co, inst204_s, inst205_co, inst205_s, inst206_co, inst206_s,
       inst207_co, inst207_s, inst208_co, inst208_s, inst209_co, inst209_s, inst210_co, inst210_s,
       inst211_co, inst211_s, inst212_co, inst212_s, inst213_co, inst213_s, inst214_co, inst214_s,
       inst215_co, inst215_s, inst216_co, inst216_s, inst217_co, inst217_s, inst218_co, inst218_s,
       inst219_co, inst219_s, inst220_co, inst220_s, inst221_co, inst221_s, inst222_co, inst222_s,
       inst223_co, inst223_s, inst224_co, inst224_s, inst225_c, inst226_co, inst226_s, inst227_co, inst227_s,
       inst228_co, inst228_s, inst229_co, inst229_s, inst230_co, inst230_s, inst231_co, inst231_s,
       inst232_co, inst232_s, inst233_co, inst233_s, inst234_co, inst234_s, inst235_co, inst235_s,
       inst236_co, inst236_s, inst237_co, inst237_s, inst238_co, inst238_s, inst239_co, inst239_s,
       inst240_co, inst240_s, inst241_co, inst241_s, inst242_co, inst242_s, inst243_co, inst243_s,
       inst244_co, inst244_s, inst245_co, inst245_s, inst246_co, inst246_s, inst247_co, inst247_s,
       inst248_co, inst248_s, inst249_co, inst249_s, inst250_co, inst250_s, inst251_co, inst251_s,
       inst252_co, inst252_s, inst253_co, inst253_s, inst254_co, inst254_s, inst255_co, inst255_s,
       inst256_co, inst256_s, inst257_c, inst258_co, inst258_s, inst259_co, inst259_s, inst260_co, inst260_s,
       inst261_co, inst261_s, inst262_co, inst262_s, inst263_co, inst263_s, inst264_co, inst264_s,
       inst265_co, inst265_s, inst266_co, inst266_s, inst267_co, inst267_s, inst268_co, inst268_s,
       inst269_co, inst269_s, inst270_co, inst270_s, inst271_co, inst271_s, inst272_co, inst272_s,
       inst273_co, inst273_s, inst274_co, inst274_s, inst275_co, inst275_s, inst276_co, inst276_s,
       inst277_co, inst277_s, inst278_co, inst278_s, inst279_co, inst279_s, inst280_co, inst280_s,
       inst281_co, inst281_s, inst282_co, inst282_s, inst283_co, inst283_s, inst284_co, inst284_s,
       inst285_co, inst285_s, inst286_co, inst286_s, inst287_co, inst287_s, inst288_co, inst288_s, inst289_c,
       inst290_co, inst290_s, inst291_co, inst291_s, inst292_co, inst292_s, inst293_co, inst293_s,
       inst294_co, inst294_s, inst295_co, inst295_s, inst296_co, inst296_s, inst297_co, inst297_s,
       inst298_co, inst298_s, inst299_co, inst299_s, inst300_co, inst300_s, inst301_co, inst301_s,
       inst302_co, inst302_s, inst303_co, inst303_s, inst304_co, inst304_s, inst305_co, inst305_s,
       inst306_co, inst306_s, inst307_co, inst307_s, inst308_co, inst308_s, inst309_co, inst309_s,
       inst310_co, inst310_s, inst311_co, inst311_s, inst312_co, inst312_s, inst313_co, inst313_s,
       inst314_co, inst314_s, inst315_co, inst315_s, inst316_co, inst316_s, inst317_co, inst317_s,
       inst318_co, inst318_s, inst319_co, inst319_s, inst320_co, inst320_s, inst321_c, inst322_co, inst322_s,
       inst323_co, inst323_s, inst324_co, inst324_s, inst325_co, inst325_s, inst326_co, inst326_s,
       inst327_co, inst327_s, inst328_co, inst328_s, inst329_co, inst329_s, inst330_co, inst330_s,
       inst331_co, inst331_s, inst332_co, inst332_s, inst333_co, inst333_s, inst334_co, inst334_s,
       inst335_co, inst335_s, inst336_co, inst336_s, inst337_co, inst337_s, inst338_co, inst338_s,
       inst339_co, inst339_s, inst340_co, inst340_s, inst341_co, inst341_s, inst342_co, inst342_s,
       inst343_co, inst343_s, inst344_co, inst344_s, inst345_co, inst345_s, inst346_co, inst346_s,
       inst347_co, inst347_s, inst348_co, inst348_s, inst349_co, inst349_s, inst350_co, inst350_s,
       inst351_co, inst351_s, inst352_co, inst352_s, inst353_c, inst354_co, inst354_s, inst355_co, inst355_s,
       inst356_co, inst356_s, inst357_co, inst357_s, inst358_co, inst358_s, inst359_co, inst359_s,
       inst360_co, inst360_s, inst361_co, inst361_s, inst362_co, inst362_s, inst363_co, inst363_s,
       inst364_co, inst364_s, inst365_co, inst365_s, inst366_co, inst366_s, inst367_co, inst367_s,
       inst368_co, inst368_s, inst369_co, inst369_s, inst370_co, inst370_s, inst371_co, inst371_s,
       inst372_co, inst372_s, inst373_co, inst373_s, inst374_co, inst374_s, inst375_co, inst375_s,
       inst376_co, inst376_s, inst377_co, inst377_s, inst378_co, inst378_s, inst379_co, inst379_s,
       inst380_co, inst380_s, inst381_co, inst381_s, inst382_co, inst382_s, inst383_co, inst383_s,
       inst384_co, inst384_s, inst385_c, inst386_co, inst386_s, inst387_co, inst387_s, inst388_co, inst388_s,
       inst389_co, inst389_s, inst390_co, inst390_s, inst391_co, inst391_s, inst392_co, inst392_s,
       inst393_co, inst393_s, inst394_co, inst394_s, inst395_co, inst395_s, inst396_co, inst396_s,
       inst397_co, inst397_s, inst398_co, inst398_s, inst399_co, inst399_s, inst400_co, inst400_s,
       inst401_co, inst401_s, inst402_co, inst402_s, inst403_co, inst403_s, inst404_co, inst404_s,
       inst405_co, inst405_s, inst406_co, inst406_s, inst407_co, inst407_s, inst408_co, inst408_s,
       inst409_co, inst409_s, inst410_co, inst410_s, inst411_co, inst411_s, inst412_co, inst412_s,
       inst413_co, inst413_s, inst414_co, inst414_s, inst415_co, inst415_s, inst416_co, inst416_s, inst417_c,
       inst418_co, inst418_s, inst419_co, inst419_s, inst420_co, inst420_s, inst421_co, inst421_s,
       inst422_co, inst422_s, inst423_co, inst423_s, inst424_co, inst424_s, inst425_co, inst425_s,
       inst426_co, inst426_s, inst427_co, inst427_s, inst428_co, inst428_s, inst429_co, inst429_s,
       inst430_co, inst430_s, inst431_co, inst431_s, inst432_co, inst432_s, inst433_co, inst433_s,
       inst434_co, inst434_s, inst435_co, inst435_s, inst436_co, inst436_s, inst437_co, inst437_s,
       inst438_co, inst438_s, inst439_co, inst439_s, inst440_co, inst440_s, inst441_co, inst441_s,
       inst442_co, inst442_s, inst443_co, inst443_s, inst444_co, inst444_s, inst445_co, inst445_s,
       inst446_co, inst446_s, inst447_co, inst447_s, inst448_co, inst448_s, inst449_c, inst450_co, inst450_s,
       inst451_co, inst451_s, inst452_co, inst452_s, inst453_co, inst453_s, inst454_co, inst454_s,
       inst455_co, inst455_s, inst456_co, inst456_s, inst457_co, inst457_s, inst458_co, inst458_s,
       inst459_co, inst459_s, inst460_co, inst460_s, inst461_co, inst461_s, inst462_co, inst462_s,
       inst463_co, inst463_s, inst464_co, inst464_s, inst465_co, inst465_s, inst466_co, inst466_s,
       inst467_co, inst467_s, inst468_co, inst468_s, inst469_co, inst469_s, inst470_co, inst470_s,
       inst471_co, inst471_s, inst472_co, inst472_s, inst473_co, inst473_s, inst474_co, inst474_s,
       inst475_co, inst475_s, inst476_co, inst476_s, inst477_co, inst477_s, inst478_co, inst478_s,
       inst479_co, inst479_s, inst480_co, inst480_s, inst481_c, inst482_co, inst482_s, inst483_co, inst483_s,
       inst484_co, inst484_s, inst485_co, inst485_s, inst486_co, inst486_s, inst487_co, inst487_s,
       inst488_co, inst488_s, inst489_co, inst489_s, inst490_co, inst490_s, inst491_co, inst491_s,
       inst492_co, inst492_s, inst493_co, inst493_s, inst494_co, inst494_s, inst495_co, inst495_s,
       inst496_co, inst496_s, inst497_co, inst497_s, inst498_co, inst498_s, inst499_co, inst499_s,
       inst500_co, inst500_s, inst501_co, inst501_s, inst502_co, inst502_s, inst503_co, inst503_s,
       inst504_co, inst504_s, inst505_co, inst505_s, inst506_co, inst506_s, inst507_co, inst507_s,
       inst508_co, inst508_s, inst509_co, inst509_s, inst510_co, inst510_s, inst511_co, inst511_s,
       inst512_co, inst512_s, inst513_c, inst514_co, inst514_s, inst515_co, inst515_s, inst516_co, inst516_s,
       inst517_co, inst517_s, inst518_co, inst518_s, inst519_co, inst519_s, inst520_co, inst520_s,
       inst521_co, inst521_s, inst522_co, inst522_s, inst523_co, inst523_s, inst524_co, inst524_s,
       inst525_co, inst525_s, inst526_co, inst526_s, inst527_co, inst527_s, inst528_co, inst528_s,
       inst529_co, inst529_s, inst530_co, inst530_s, inst531_co, inst531_s, inst532_co, inst532_s,
       inst533_co, inst533_s, inst534_co, inst534_s, inst535_co, inst535_s, inst536_co, inst536_s,
       inst537_co, inst537_s, inst538_co, inst538_s, inst539_co, inst539_s, inst540_co, inst540_s,
       inst541_co, inst541_s, inst542_co, inst542_s, inst543_co, inst543_s, inst544_co, inst544_s, inst545_c,
       inst546_co, inst546_s, inst547_co, inst547_s, inst548_co, inst548_s, inst549_co, inst549_s,
       inst550_co, inst550_s, inst551_co, inst551_s, inst552_co, inst552_s, inst553_co, inst553_s,
       inst554_co, inst554_s, inst555_co, inst555_s, inst556_co, inst556_s, inst557_co, inst557_s,
       inst558_co, inst558_s, inst559_co, inst559_s, inst560_co, inst560_s, inst561_co, inst561_s,
       inst562_co, inst562_s, inst563_co, inst563_s, inst564_co, inst564_s, inst565_co, inst565_s,
       inst566_co, inst566_s, inst567_co, inst567_s, inst568_co, inst568_s, inst569_co, inst569_s,
       inst570_co, inst570_s, inst571_co, inst571_s, inst572_co, inst572_s, inst573_co, inst573_s,
       inst574_co, inst574_s, inst575_co, inst575_s, inst576_co, inst576_s, inst577_c, inst578_co, inst578_s,
       inst579_co, inst579_s, inst580_co, inst580_s, inst581_co, inst581_s, inst582_co, inst582_s,
       inst583_co, inst583_s, inst584_co, inst584_s, inst585_co, inst585_s, inst586_co, inst586_s,
       inst587_co, inst587_s, inst588_co, inst588_s, inst589_co, inst589_s, inst590_co, inst590_s,
       inst591_co, inst591_s, inst592_co, inst592_s, inst593_co, inst593_s, inst594_co, inst594_s,
       inst595_co, inst595_s, inst596_co, inst596_s, inst597_co, inst597_s, inst598_co, inst598_s,
       inst599_co, inst599_s, inst600_co, inst600_s, inst601_co, inst601_s, inst602_co, inst602_s,
       inst603_co, inst603_s, inst604_co, inst604_s, inst605_co, inst605_s, inst606_co, inst606_s,
       inst607_co, inst607_s, inst608_co, inst608_s, inst609_c, inst610_co, inst610_s, inst611_co, inst611_s,
       inst612_co, inst612_s, inst613_co, inst613_s, inst614_co, inst614_s, inst615_co, inst615_s,
       inst616_co, inst616_s, inst617_co, inst617_s, inst618_co, inst618_s, inst619_co, inst619_s,
       inst620_co, inst620_s, inst621_co, inst621_s, inst622_co, inst622_s, inst623_co, inst623_s,
       inst624_co, inst624_s, inst625_co, inst625_s, inst626_co, inst626_s, inst627_co, inst627_s,
       inst628_co, inst628_s, inst629_co, inst629_s, inst630_co, inst630_s, inst631_co, inst631_s,
       inst632_co, inst632_s, inst633_co, inst633_s, inst634_co, inst634_s, inst635_co, inst635_s,
       inst636_co, inst636_s, inst637_co, inst637_s, inst638_co, inst638_s, inst639_co, inst639_s,
       inst640_co, inst640_s, inst641_c, inst642_co, inst642_s, inst643_co, inst643_s, inst644_co, inst644_s,
       inst645_co, inst645_s, inst646_co, inst646_s, inst647_co, inst647_s, inst648_co, inst648_s,
       inst649_co, inst649_s, inst650_co, inst650_s, inst651_co, inst651_s, inst652_co, inst652_s,
       inst653_co, inst653_s, inst654_co, inst654_s, inst655_co, inst655_s, inst656_co, inst656_s,
       inst657_co, inst657_s, inst658_co, inst658_s, inst659_co, inst659_s, inst660_co, inst660_s,
       inst661_co, inst661_s, inst662_co, inst662_s, inst663_co, inst663_s, inst664_co, inst664_s,
       inst665_co, inst665_s, inst666_co, inst666_s, inst667_co, inst667_s, inst668_co, inst668_s,
       inst669_co, inst669_s, inst670_co, inst670_s, inst671_co, inst671_s, inst672_co, inst672_s, inst673_c,
       inst674_co, inst674_s, inst675_co, inst675_s, inst676_co, inst676_s, inst677_co, inst677_s,
       inst678_co, inst678_s, inst679_co, inst679_s, inst680_co, inst680_s, inst681_co, inst681_s,
       inst682_co, inst682_s, inst683_co, inst683_s, inst684_co, inst684_s, inst685_co, inst685_s,
       inst686_co, inst686_s, inst687_co, inst687_s, inst688_co, inst688_s, inst689_co, inst689_s,
       inst690_co, inst690_s, inst691_co, inst691_s, inst692_co, inst692_s, inst693_co, inst693_s,
       inst694_co, inst694_s, inst695_co, inst695_s, inst696_co, inst696_s, inst697_co, inst697_s,
       inst698_co, inst698_s, inst699_co, inst699_s, inst700_co, inst700_s, inst701_co, inst701_s,
       inst702_co, inst702_s, inst703_co, inst703_s, inst704_co, inst704_s, inst705_c, inst706_co, inst706_s,
       inst707_co, inst707_s, inst708_co, inst708_s, inst709_co, inst709_s, inst710_co, inst710_s,
       inst711_co, inst711_s, inst712_co, inst712_s, inst713_co, inst713_s, inst714_co, inst714_s,
       inst715_co, inst715_s, inst716_co, inst716_s, inst717_co, inst717_s, inst718_co, inst718_s,
       inst719_co, inst719_s, inst720_co, inst720_s, inst721_co, inst721_s, inst722_co, inst722_s,
       inst723_co, inst723_s, inst724_co, inst724_s, inst725_co, inst725_s, inst726_co, inst726_s,
       inst727_co, inst727_s, inst728_co, inst728_s, inst729_co, inst729_s, inst730_co, inst730_s,
       inst731_co, inst731_s, inst732_co, inst732_s, inst733_co, inst733_s, inst734_co, inst734_s,
       inst735_co, inst735_s, inst736_co, inst736_s, inst737_c, inst738_co, inst738_s, inst739_co, inst739_s,
       inst740_co, inst740_s, inst741_co, inst741_s, inst742_co, inst742_s, inst743_co, inst743_s,
       inst744_co, inst744_s, inst745_co, inst745_s, inst746_co, inst746_s, inst747_co, inst747_s,
       inst748_co, inst748_s, inst749_co, inst749_s, inst750_co, inst750_s, inst751_co, inst751_s,
       inst752_co, inst752_s, inst753_co, inst753_s, inst754_co, inst754_s, inst755_co, inst755_s,
       inst756_co, inst756_s, inst757_co, inst757_s, inst758_co, inst758_s, inst759_co, inst759_s,
       inst760_co, inst760_s, inst761_co, inst761_s, inst762_co, inst762_s, inst763_co, inst763_s,
       inst764_co, inst764_s, inst765_co, inst765_s, inst766_co, inst766_s, inst767_co, inst767_s,
       inst768_co, inst768_s, inst769_c, inst770_co, inst770_s, inst771_co, inst771_s, inst772_co, inst772_s,
       inst773_co, inst773_s, inst774_co, inst774_s, inst775_co, inst775_s, inst776_co, inst776_s,
       inst777_co, inst777_s, inst778_co, inst778_s, inst779_co, inst779_s, inst780_co, inst780_s,
       inst781_co, inst781_s, inst782_co, inst782_s, inst783_co, inst783_s, inst784_co, inst784_s,
       inst785_co, inst785_s, inst786_co, inst786_s, inst787_co, inst787_s, inst788_co, inst788_s,
       inst789_co, inst789_s, inst790_co, inst790_s, inst791_co, inst791_s, inst792_co, inst792_s,
       inst793_co, inst793_s, inst794_co, inst794_s, inst795_co, inst795_s, inst796_co, inst796_s,
       inst797_co, inst797_s, inst798_co, inst798_s, inst799_co, inst799_s, inst800_co, inst800_s, inst801_c,
       inst802_co, inst802_s, inst803_co, inst803_s, inst804_co, inst804_s, inst805_co, inst805_s,
       inst806_co, inst806_s, inst807_co, inst807_s, inst808_co, inst808_s, inst809_co, inst809_s,
       inst810_co, inst810_s, inst811_co, inst811_s, inst812_co, inst812_s, inst813_co, inst813_s,
       inst814_co, inst814_s, inst815_co, inst815_s, inst816_co, inst816_s, inst817_co, inst817_s,
       inst818_co, inst818_s, inst819_co, inst819_s, inst820_co, inst820_s, inst821_co, inst821_s,
       inst822_co, inst822_s, inst823_co, inst823_s, inst824_co, inst824_s, inst825_co, inst825_s,
       inst826_co, inst826_s, inst827_co, inst827_s, inst828_co, inst828_s, inst829_co, inst829_s,
       inst830_co, inst830_s, inst831_co, inst831_s, inst832_co, inst832_s, inst833_c, inst834_co, inst834_s,
       inst835_co, inst835_s, inst836_co, inst836_s, inst837_co, inst837_s, inst838_co, inst838_s,
       inst839_co, inst839_s, inst840_co, inst840_s, inst841_co, inst841_s, inst842_co, inst842_s,
       inst843_co, inst843_s, inst844_co, inst844_s, inst845_co, inst845_s, inst846_co, inst846_s,
       inst847_co, inst847_s, inst848_co, inst848_s, inst849_co, inst849_s, inst850_co, inst850_s,
       inst851_co, inst851_s, inst852_co, inst852_s, inst853_co, inst853_s, inst854_co, inst854_s,
       inst855_co, inst855_s, inst856_co, inst856_s, inst857_co, inst857_s, inst858_co, inst858_s,
       inst859_co, inst859_s, inst860_co, inst860_s, inst861_co, inst861_s, inst862_co, inst862_s,
       inst863_co, inst863_s, inst864_co, inst864_s, inst865_c, inst866_co, inst866_s, inst867_co, inst867_s,
       inst868_co, inst868_s, inst869_co, inst869_s, inst870_co, inst870_s, inst871_co, inst871_s,
       inst872_co, inst872_s, inst873_co, inst873_s, inst874_co, inst874_s, inst875_co, inst875_s,
       inst876_co, inst876_s, inst877_co, inst877_s, inst878_co, inst878_s, inst879_co, inst879_s,
       inst880_co, inst880_s, inst881_co, inst881_s, inst882_co, inst882_s, inst883_co, inst883_s,
       inst884_co, inst884_s, inst885_co, inst885_s, inst886_co, inst886_s, inst887_co, inst887_s,
       inst888_co, inst888_s, inst889_co, inst889_s, inst890_co, inst890_s, inst891_co, inst891_s,
       inst892_co, inst892_s, inst893_co, inst893_s, inst894_co, inst894_s, inst895_co, inst895_s,
       inst896_co, inst896_s, inst897_c, inst898_co, inst898_s, inst899_co, inst899_s, inst900_co, inst900_s,
       inst901_co, inst901_s, inst902_co, inst902_s, inst903_co, inst903_s, inst904_co, inst904_s,
       inst905_co, inst905_s, inst906_co, inst906_s, inst907_co, inst907_s, inst908_co, inst908_s,
       inst909_co, inst909_s, inst910_co, inst910_s, inst911_co, inst911_s, inst912_co, inst912_s,
       inst913_co, inst913_s, inst914_co, inst914_s, inst915_co, inst915_s, inst916_co, inst916_s,
       inst917_co, inst917_s, inst918_co, inst918_s, inst919_co, inst919_s, inst920_co, inst920_s,
       inst921_co, inst921_s, inst922_co, inst922_s, inst923_co, inst923_s, inst924_co, inst924_s,
       inst925_co, inst925_s, inst926_co, inst926_s, inst927_co, inst927_s, inst928_co, inst928_s, inst929_c,
       inst930_co, inst930_s, inst931_co, inst931_s, inst932_co, inst932_s, inst933_co, inst933_s,
       inst934_co, inst934_s, inst935_co, inst935_s, inst936_co, inst936_s, inst937_co, inst937_s,
       inst938_co, inst938_s, inst939_co, inst939_s, inst940_co, inst940_s, inst941_co, inst941_s,
       inst942_co, inst942_s, inst943_co, inst943_s, inst944_co, inst944_s, inst945_co, inst945_s,
       inst946_co, inst946_s, inst947_co, inst947_s, inst948_co, inst948_s, inst949_co, inst949_s,
       inst950_co, inst950_s, inst951_co, inst951_s, inst952_co, inst952_s, inst953_co, inst953_s,
       inst954_co, inst954_s, inst955_co, inst955_s, inst956_co, inst956_s, inst957_co, inst957_s,
       inst958_co, inst958_s, inst959_co, inst959_s, inst960_co, inst960_s, inst961_c, inst962_co, inst962_s,
       inst963_co, inst963_s, inst964_co, inst964_s, inst965_co, inst965_s, inst966_co, inst966_s,
       inst967_co, inst967_s, inst968_co, inst968_s, inst969_co, inst969_s, inst970_co, inst970_s,
       inst971_co, inst971_s, inst972_co, inst972_s, inst973_co, inst973_s, inst974_co, inst974_s,
       inst975_co, inst975_s, inst976_co, inst976_s, inst977_co, inst977_s, inst978_co, inst978_s,
       inst979_co, inst979_s, inst980_co, inst980_s, inst981_co, inst981_s, inst982_co, inst982_s,
       inst983_co, inst983_s, inst984_co, inst984_s, inst985_co, inst985_s, inst986_co, inst986_s,
       inst987_co, inst987_s, inst988_co, inst988_s, inst989_co, inst989_s, inst990_co, inst990_s,
       inst991_co, inst991_s, inst992_co, inst992_s, inst993_c, inst994_co, inst994_s, inst995_co, inst995_s,
       inst996_co, inst996_s, inst997_co, inst997_s, inst998_co, inst998_s, inst999_co, inst999_s,
       inst1000_co, inst1000_s, inst1001_co, inst1001_s, inst1002_co, inst1002_s, inst1003_co, inst1003_s,
       inst1004_co, inst1004_s, inst1005_co, inst1005_s, inst1006_co, inst1006_s, inst1007_co, inst1007_s,
       inst1008_co, inst1008_s, inst1009_co, inst1009_s, inst1010_co, inst1010_s, inst1011_co, inst1011_s,
       inst1012_co, inst1012_s, inst1013_co, inst1013_s, inst1014_co, inst1014_s, inst1015_co, inst1015_s,
       inst1016_co, inst1016_s, inst1017_co, inst1017_s, inst1018_co, inst1018_s, inst1019_co, inst1019_s,
       inst1020_co, inst1020_s, inst1021_co, inst1021_s, inst1022_co, inst1022_s, inst1023_co, inst1023_s,
       inst1024_co, inst1024_s, inst1025_out, inst1026_out, inst1027_out, inst1028_out, inst1029_out,
       inst1030_out, inst1031_out, inst1032_out, inst1033_out, inst1034_out, inst1035_out, inst1036_out,
       inst1037_out, inst1038_out, inst1039_out, inst1040_out, inst1041_out, inst1042_out, inst1043_out,
       inst1044_out, inst1045_out, inst1046_out, inst1047_out, inst1048_out, inst1049_out, inst1050_out,
       inst1051_out, inst1052_out, inst1053_out, inst1054_out, inst1055_out, inst1056_out, inst1057_out,
       inst1058_out, inst1059_out, inst1060_out, inst1061_out, inst1062_out, inst1063_out, inst1064_out,
       inst1065_out, inst1066_out, inst1067_out, inst1068_out, inst1069_out, inst1070_out, inst1071_out,
       inst1072_out, inst1073_out, inst1074_out, inst1075_out, inst1076_out, inst1077_out, inst1078_out,
       inst1079_out, inst1080_out, inst1081_out, inst1082_out, inst1083_out, inst1084_out, inst1085_out,
       inst1086_out, inst1087_out, inst1089_out, inst1090_out, inst1091_out, inst1092_out, inst1093_out,
       inst1094_out, inst1095_out, inst1096_out, inst1097_out, inst1098_out, inst1099_out, inst1100_out,
       inst1101_out, inst1102_out, inst1103_out, inst1104_out, inst1105_out, inst1106_out, inst1107_out,
       inst1108_out, inst1109_out, inst1110_out, inst1111_out, inst1112_out, inst1113_out, inst1114_out,
       inst1115_out, inst1116_out, inst1117_out, inst1118_out, inst1119_out, inst1120_out, inst1121_out,
       inst1122_out, inst1123_out, inst1124_out, inst1125_out, inst1126_out, inst1127_out, inst1128_out,
       inst1129_out, inst1130_out, inst1131_out, inst1132_out, inst1133_out, inst1134_out, inst1135_out,
       inst1136_out, inst1137_out, inst1138_out, inst1139_out, inst1140_out, inst1141_out, inst1142_out,
       inst1143_out, inst1144_out, inst1145_out, inst1146_out, inst1147_out, inst1148_out, inst1149_out,
       inst1150_out, inst1151_out, inst1152_out, inst1153_out, inst1154_out, inst1155_out, inst1156_out,
       inst1157_out, inst1158_out, inst1159_out, inst1160_out, inst1161_out, inst1162_out, inst1163_out,
       inst1164_out, inst1165_out, inst1166_out, inst1167_out, inst1168_out, inst1169_out, inst1170_out,
       inst1171_out, inst1172_out, inst1173_out, inst1174_out, inst1175_out, inst1176_out, inst1177_out,
       inst1178_out, inst1179_out, inst1180_out, inst1181_out, inst1182_out, inst1183_out, inst1184_out,
       inst1185_out, inst1186_out, inst1187_out, inst1188_out, inst1189_out, inst1190_out, inst1191_out,
       inst1192_out, inst1193_out, inst1194_out, inst1195_out, inst1196_out, inst1197_out, inst1198_out,
       inst1199_out, inst1200_out, inst1201_out, inst1202_out, inst1203_out, inst1204_out, inst1205_out,
       inst1206_out, inst1207_out, inst1208_out, inst1209_out, inst1210_out, inst1211_out, inst1212_out,
       inst1213_out, inst1214_out, inst1215_out, inst1216_out, inst1217_out, inst1218_out, inst1219_out,
       inst1220_out, inst1221_out, inst1222_out, inst1223_out, inst1224_out, inst1225_out, inst1226_out,
       inst1227_out, inst1228_out, inst1229_out, inst1230_out, inst1231_out, inst1232_out, inst1233_out,
       inst1234_out, inst1235_out, inst1236_out, inst1237_out, inst1238_out, inst1239_out, inst1240_out,
       inst1241_out, inst1242_out, inst1243_out, inst1244_out, inst1245_out, inst1246_out, inst1247_out,
       inst1248_out, inst1249_out, inst1250_out, inst1251_out, inst1252_out, inst1253_out, inst1254_out,
       inst1255_out, inst1256_out, inst1257_out, inst1258_out, inst1259_out, inst1260_out, inst1261_out,
       inst1262_out, inst1263_out, inst1264_out, inst1265_out, inst1266_out, inst1267_out, inst1268_out,
       inst1269_out, inst1270_out, inst1271_out, inst1272_out, inst1273_out, inst1274_out, inst1275_out,
       inst1276_out, inst1277_out, inst1278_out, inst1279_out, inst1280_out, inst1281_out, inst1282_out,
       inst1283_out, inst1284_out, inst1285_out, inst1286_out, inst1287_out, inst1288_out, inst1289_out,
       inst1290_out, inst1291_out, inst1292_out, inst1293_out, inst1294_out, inst1295_out, inst1296_out,
       inst1297_out, inst1298_out, inst1299_out, inst1300_out, inst1301_out, inst1302_out, inst1303_out,
       inst1304_out, inst1305_out, inst1306_out, inst1307_out, inst1308_out, inst1309_out, inst1310_out,
       inst1311_out, inst1312_out, inst1313_out, inst1314_out, inst1315_out, inst1316_out, inst1317_out,
       inst1318_out, inst1319_out, inst1320_out, inst1321_out, inst1322_out, inst1323_out, inst1324_out,
       inst1325_out, inst1326_out, inst1327_out, inst1328_out, inst1329_out, inst1330_out, inst1331_out,
       inst1332_out, inst1333_out, inst1334_out, inst1335_out, inst1336_out, inst1337_out, inst1338_out,
       inst1339_out, inst1340_out, inst1341_out, inst1342_out, inst1343_out, inst1344_out, inst1345_out,
       inst1346_out, inst1347_out, inst1348_out, inst1349_out, inst1350_out, inst1351_out, inst1352_out,
       inst1353_out, inst1354_out, inst1355_out, inst1356_out, inst1357_out, inst1358_out, inst1359_out,
       inst1360_out, inst1361_out, inst1362_out, inst1363_out, inst1364_out, inst1365_out, inst1366_out,
       inst1367_out, inst1368_out, inst1369_out, inst1370_out, inst1371_out, inst1372_out, inst1373_out,
       inst1374_out, inst1375_out, inst1376_out, inst1377_out, inst1378_out, inst1379_out, inst1380_out,
       inst1381_out, inst1382_out, inst1383_out, inst1384_out, inst1385_out, inst1386_out, inst1387_out,
       inst1388_out, inst1389_out, inst1390_out, inst1391_out, inst1392_out, inst1393_out, inst1394_out,
       inst1395_out, inst1396_out, inst1397_out, inst1398_out, inst1399_out, inst1400_out, inst1401_out,
       inst1402_out, inst1403_out, inst1404_out, inst1405_out, inst1406_out, inst1407_out, inst1408_out,
       inst1409_out, inst1410_out, inst1411_out, inst1412_out, inst1413_out, inst1414_out, inst1415_out,
       inst1416_out, inst1417_out, inst1418_out, inst1419_out, inst1420_out, inst1421_out, inst1422_out,
       inst1423_out, inst1424_out, inst1425_out, inst1426_out, inst1427_out, inst1428_out, inst1429_out,
       inst1430_out, inst1431_out, inst1432_out, inst1433_out, inst1434_out, inst1435_out, inst1436_out,
       inst1437_out, inst1438_out, inst1439_out, inst1440_out, inst1441_out, inst1442_out, inst1443_out,
       inst1444_out, inst1445_out, inst1446_out, inst1447_out, inst1448_out, inst1449_out, inst1450_out,
       inst1451_out, inst1452_out, inst1453_out, inst1454_out, inst1455_out, inst1456_out, inst1457_out,
       inst1458_out, inst1459_out, inst1460_out, inst1461_out, inst1462_out, inst1463_out, inst1464_out,
       inst1465_out, inst1466_out, inst1467_out, inst1468_out, inst1469_out, inst1470_out, inst1471_out,
       inst1472_out, inst1473_out, inst1474_out, inst1475_out, inst1476_out, inst1477_out, inst1478_out,
       inst1479_out, inst1480_out, inst1481_out, inst1482_out, inst1483_out, inst1484_out, inst1485_out,
       inst1486_out, inst1487_out, inst1488_out, inst1489_out, inst1490_out, inst1491_out, inst1492_out,
       inst1493_out, inst1494_out, inst1495_out, inst1496_out, inst1497_out, inst1498_out, inst1499_out,
       inst1500_out, inst1501_out, inst1502_out, inst1503_out, inst1504_out, inst1505_out, inst1506_out,
       inst1507_out, inst1508_out, inst1509_out, inst1510_out, inst1511_out, inst1512_out, inst1513_out,
       inst1514_out, inst1515_out, inst1516_out, inst1517_out, inst1518_out, inst1519_out, inst1520_out,
       inst1521_out, inst1522_out, inst1523_out, inst1524_out, inst1525_out, inst1526_out, inst1527_out,
       inst1528_out, inst1529_out, inst1530_out, inst1531_out, inst1532_out, inst1533_out, inst1534_out,
       inst1535_out, inst1536_out, inst1537_out, inst1538_out, inst1539_out, inst1540_out, inst1541_out,
       inst1542_out, inst1543_out, inst1544_out, inst1545_out, inst1546_out, inst1547_out, inst1548_out,
       inst1549_out, inst1550_out, inst1551_out, inst1552_out, inst1553_out, inst1554_out, inst1555_out,
       inst1556_out, inst1557_out, inst1558_out, inst1559_out, inst1560_out, inst1561_out, inst1562_out,
       inst1563_out, inst1564_out, inst1565_out, inst1566_out, inst1567_out, inst1568_out, inst1569_out,
       inst1570_out, inst1571_out, inst1572_out, inst1573_out, inst1574_out, inst1575_out, inst1576_out,
       inst1577_out, inst1578_out, inst1579_out, inst1580_out, inst1581_out, inst1582_out, inst1583_out,
       inst1584_out, inst1585_out, inst1586_out, inst1587_out, inst1588_out, inst1589_out, inst1590_out,
       inst1591_out, inst1592_out, inst1593_out, inst1594_out, inst1595_out, inst1596_out, inst1597_out,
       inst1598_out, inst1599_out, inst1600_out, inst1601_out, inst1602_out, inst1603_out, inst1604_out,
       inst1605_out, inst1606_out, inst1607_out, inst1608_out, inst1609_out, inst1610_out, inst1611_out,
       inst1612_out, inst1613_out, inst1614_out, inst1615_out, inst1616_out, inst1617_out, inst1618_out,
       inst1619_out, inst1620_out, inst1621_out, inst1622_out, inst1623_out, inst1624_out, inst1625_out,
       inst1626_out, inst1627_out, inst1628_out, inst1629_out, inst1630_out, inst1631_out, inst1632_out,
       inst1633_out, inst1634_out, inst1635_out, inst1636_out, inst1637_out, inst1638_out, inst1639_out,
       inst1640_out, inst1641_out, inst1642_out, inst1643_out, inst1644_out, inst1645_out, inst1646_out,
       inst1647_out, inst1648_out, inst1649_out, inst1650_out, inst1651_out, inst1652_out, inst1653_out,
       inst1654_out, inst1655_out, inst1656_out, inst1657_out, inst1658_out, inst1659_out, inst1660_out,
       inst1661_out, inst1662_out, inst1663_out, inst1664_out, inst1665_out, inst1666_out, inst1667_out,
       inst1668_out, inst1669_out, inst1670_out, inst1671_out, inst1672_out, inst1673_out, inst1674_out,
       inst1675_out, inst1676_out, inst1677_out, inst1678_out, inst1679_out, inst1680_out, inst1681_out,
       inst1682_out, inst1683_out, inst1684_out, inst1685_out, inst1686_out, inst1687_out, inst1688_out,
       inst1689_out, inst1690_out, inst1691_out, inst1692_out, inst1693_out, inst1694_out, inst1695_out,
       inst1696_out, inst1697_out, inst1698_out, inst1699_out, inst1700_out, inst1701_out, inst1702_out,
       inst1703_out, inst1704_out, inst1705_out, inst1706_out, inst1707_out, inst1708_out, inst1709_out,
       inst1710_out, inst1711_out, inst1712_out, inst1713_out, inst1714_out, inst1715_out, inst1716_out,
       inst1717_out, inst1718_out, inst1719_out, inst1720_out, inst1721_out, inst1722_out, inst1723_out,
       inst1724_out, inst1725_out, inst1726_out, inst1727_out, inst1728_out, inst1729_out, inst1730_out,
       inst1731_out, inst1732_out, inst1733_out, inst1734_out, inst1735_out, inst1736_out, inst1737_out,
       inst1738_out, inst1739_out, inst1740_out, inst1741_out, inst1742_out, inst1743_out, inst1744_out,
       inst1745_out, inst1746_out, inst1747_out, inst1748_out, inst1749_out, inst1750_out, inst1751_out,
       inst1752_out, inst1753_out, inst1754_out, inst1755_out, inst1756_out, inst1757_out, inst1758_out,
       inst1759_out, inst1760_out, inst1761_out, inst1762_out, inst1763_out, inst1764_out, inst1765_out,
       inst1766_out, inst1767_out, inst1768_out, inst1769_out, inst1770_out, inst1771_out, inst1772_out,
       inst1773_out, inst1774_out, inst1775_out, inst1776_out, inst1777_out, inst1778_out, inst1779_out,
       inst1780_out, inst1781_out, inst1782_out, inst1783_out, inst1784_out, inst1785_out, inst1786_out,
       inst1787_out, inst1788_out, inst1789_out, inst1790_out, inst1791_out, inst1792_out, inst1793_out,
       inst1794_out, inst1795_out, inst1796_out, inst1797_out, inst1798_out, inst1799_out, inst1800_out,
       inst1801_out, inst1802_out, inst1803_out, inst1804_out, inst1805_out, inst1806_out, inst1807_out,
       inst1808_out, inst1809_out, inst1810_out, inst1811_out, inst1812_out, inst1813_out, inst1814_out,
       inst1815_out, inst1816_out, inst1817_out, inst1818_out, inst1819_out, inst1820_out, inst1821_out,
       inst1822_out, inst1823_out, inst1824_out, inst1825_out, inst1826_out, inst1827_out, inst1828_out,
       inst1829_out, inst1830_out, inst1831_out, inst1832_out, inst1833_out, inst1834_out, inst1835_out,
       inst1836_out, inst1837_out, inst1838_out, inst1839_out, inst1840_out, inst1841_out, inst1842_out,
       inst1843_out, inst1844_out, inst1845_out, inst1846_out, inst1847_out, inst1848_out, inst1849_out,
       inst1850_out, inst1851_out, inst1852_out, inst1853_out, inst1854_out, inst1855_out, inst1856_out,
       inst1857_out, inst1888_out, inst1890_out, inst1891_out, inst1892_out, inst1893_out, inst1894_out,
       inst1895_out, inst1896_out, inst1897_out, inst1898_out, inst1899_out, inst1900_out, inst1901_out,
       inst1902_out, inst1903_out, inst1904_out, inst1905_out, inst1906_out, inst1907_out, inst1908_out,
       inst1909_out, inst1910_out, inst1911_out, inst1912_out, inst1913_out, inst1914_out, inst1915_out,
       inst1916_out, inst1917_out, inst1918_out, inst1919_out, inst1920_out, inst1921_out, inst1922_out,
       inst1923_out, inst1924_out, inst1925_out, inst1926_out, inst1927_out, inst1928_out, inst1929_out,
       inst1930_out, inst1931_out, inst1932_out, inst1933_out, inst1934_out, inst1935_out, inst1936_out,
       inst1937_out, inst1938_out, inst1939_out, inst1940_out, inst1941_out, inst1942_out, inst1943_out,
       inst1944_out, inst1945_out, inst1946_out, inst1947_out, inst1948_out, inst1949_out, inst1950_out,
       inst1951_out, inst1952_out, inst1953_out, inst1954_out, inst1955_out, inst1956_out, inst1957_out,
       inst1958_out, inst1959_out, inst1960_out, inst1961_out, inst1962_out, inst1963_out, inst1964_out,
       inst1965_out, inst1966_out, inst1967_out, inst1968_out, inst1969_out, inst1970_out, inst1971_out,
       inst1972_out, inst1973_out, inst1974_out, inst1975_out, inst1976_out, inst1977_out, inst1978_out,
       inst1979_out, inst1980_out, inst1981_out, inst1982_out, inst1983_out, inst1984_out, inst1985_out,
       inst1986_out, inst1987_out, inst1988_out, inst1989_out, inst1990_out, inst1991_out, inst1992_out,
       inst1993_out, inst1994_out, inst1995_out, inst1996_out, inst1997_out, inst1998_out, inst1999_out,
       inst2000_out, inst2001_out, inst2002_out, inst2003_out, inst2004_out, inst2005_out, inst2006_out,
       inst2007_out, inst2008_out, inst2009_out, inst2010_out, inst2011_out, inst2012_out, inst2013_out,
       inst2014_out, inst2015_out, inst2016_out, inst2017_out, inst2018_out, inst2019_out, inst2020_out,
       inst2021_out, inst2022_out, inst2023_out, inst2024_out, inst2025_out, inst2026_out, inst2027_out,
       inst2028_out, inst2029_out, inst2030_out, inst2031_out, inst2032_out, inst2033_out, inst2034_out,
       inst2035_out, inst2036_out, inst2037_out, inst2038_out, inst2039_out, inst2040_out, inst2041_out,
       inst2042_out, inst2043_out, inst2044_out, inst2045_out, inst2046_out, inst2047_out, inst2048_out,
       inst2049_out, inst2050_out, inst2051_out, inst2052_out, inst2053_out, inst2054_out, inst2055_out,
       inst2056_out, inst2057_out, inst2058_out, inst2059_out, inst2060_out, inst2061_out, inst2062_out,
       inst2063_out, inst2064_out, inst2065_out, inst2066_out, inst2067_out, inst2068_out, inst2069_out,
       inst2070_out, inst2071_out, inst2072_out, inst2073_out, inst2074_out, inst2075_out, inst2076_out,
       inst2077_out, inst2078_out, inst2079_out;

  OneBitAdderHalf inst3 (.A(inst49_co), .B(1'b1), .S(Z[63]));  // open: C
  and inst1857 (inst1857_out, B[31], A[31]);
  OneBitAdder inst49 (.ci(inst48_co), .a(inst1857_out), .b(inst80_co), .co(inst49_co), .s(Z[62]));
  OneBitAdder inst80 (.ci(inst79_co), .a(inst2019_out), .b(inst112_co), .co(inst80_co), .s(inst80_s));
  OneBitAdder inst48 (.ci(inst47_co), .a(inst2079_out), .b(inst80_s), .co(inst48_co), .s(Z[61]));
  nand inst2019 (inst2019_out, B[30], A[31]);
  nand inst2079 (inst2079_out, B[31], A[30]);
  OneBitAdder inst112 (.ci(inst111_co), .a(inst1987_out), .b(inst144_co), .co(inst112_co), .s(inst112_s));
  and inst2018 (inst2018_out, B[30], A[30]);
  OneBitAdder inst79 (.ci(inst78_co), .a(inst2018_out), .b(inst112_s), .co(inst79_co), .s(inst79_s));
  nand inst2078 (inst2078_out, B[31], A[29]);
  OneBitAdder inst47 (.ci(inst46_co), .a(inst2078_out), .b(inst79_s), .co(inst47_co), .s(Z[60]));
  nand inst1987 (inst1987_out, B[29], A[31]);
  OneBitAdder inst78 (.ci(inst77_co), .a(inst2020_out), .b(inst111_s), .co(inst78_co), .s(inst78_s));
  nand inst2077 (inst2077_out, B[31], A[28]);
  OneBitAdder inst46 (.ci(inst45_co), .a(inst2077_out), .b(inst78_s), .co(inst46_co), .s(Z[59]));
  nand inst1955 (inst1955_out, B[28], A[31]);
  OneBitAdder inst144 (.ci(inst143_co), .a(inst1955_out), .b(inst176_co), .co(inst144_co), .s(inst144_s));
  and inst1986 (inst1986_out, B[29], A[30]);
  OneBitAdder inst111 (.ci(inst110_co), .a(inst1986_out), .b(inst144_s), .co(inst111_co), .s(inst111_s));
  and inst2020 (inst2020_out, B[30], A[29]);
  nand inst1923 (inst1923_out, B[27], A[31]);
  OneBitAdder inst176 (.ci(inst175_co), .a(inst1923_out), .b(inst208_co), .co(inst176_co), .s(inst176_s));
  and inst1954 (inst1954_out, B[28], A[30]);
  OneBitAdder inst143 (.ci(inst142_co), .a(inst1954_out), .b(inst176_s), .co(inst143_co), .s(inst143_s));
  and inst1988 (inst1988_out, B[29], A[29]);
  OneBitAdder inst110 (.ci(inst109_co), .a(inst1988_out), .b(inst143_s), .co(inst110_co), .s(inst110_s));
  and inst2021 (inst2021_out, B[30], A[28]);
  OneBitAdder inst77 (.ci(inst76_co), .a(inst2021_out), .b(inst110_s), .co(inst77_co), .s(inst77_s));
  nand inst2076 (inst2076_out, B[31], A[27]);
  OneBitAdder inst45 (.ci(inst44_co), .a(inst2076_out), .b(inst77_s), .co(inst45_co), .s(Z[58]));
  OneBitAdder inst208 (.ci(inst207_co), .a(inst1891_out), .b(inst240_co), .co(inst208_co), .s(inst208_s));
  OneBitAdder inst175 (.ci(inst174_co), .a(inst1922_out), .b(inst208_s), .co(inst175_co), .s(inst175_s));
  OneBitAdder inst142 (.ci(inst141_co), .a(inst1956_out), .b(inst175_s), .co(inst142_co), .s(inst142_s));
  OneBitAdder inst109 (.ci(inst108_co), .a(inst1989_out), .b(inst142_s), .co(inst109_co), .s(inst109_s));
  and inst2022 (inst2022_out, B[30], A[27]);
  OneBitAdder inst76 (.ci(inst75_co), .a(inst2022_out), .b(inst109_s), .co(inst76_co), .s(inst76_s));
  nand inst2075 (inst2075_out, B[31], A[26]);
  OneBitAdder inst44 (.ci(inst43_co), .a(inst2075_out), .b(inst76_s), .co(inst44_co), .s(Z[57]));
  nand inst1891 (inst1891_out, B[26], A[31]);
  and inst1922 (inst1922_out, B[27], A[30]);
  and inst1956 (inst1956_out, B[28], A[29]);
  and inst1989 (inst1989_out, B[29], A[28]);
  OneBitAdder inst75 (.ci(inst74_co), .a(inst2023_out), .b(inst108_s), .co(inst75_co), .s(inst75_s));
  OneBitAdder inst43 (.ci(inst42_co), .a(inst2074_out), .b(inst75_s), .co(inst43_co), .s(Z[56]));
  nand inst1826 (inst1826_out, B[25], A[31]);
  OneBitAdder inst240 (.ci(inst239_co), .a(inst1826_out), .b(inst272_co), .co(inst240_co), .s(inst240_s));
  and inst1890 (inst1890_out, B[26], A[30]);
  OneBitAdder inst207 (.ci(inst206_co), .a(inst1890_out), .b(inst240_s), .co(inst207_co), .s(inst207_s));
  and inst1924 (inst1924_out, B[27], A[29]);
  OneBitAdder inst174 (.ci(inst173_co), .a(inst1924_out), .b(inst207_s), .co(inst174_co), .s(inst174_s));
  and inst1957 (inst1957_out, B[28], A[28]);
  OneBitAdder inst141 (.ci(inst140_co), .a(inst1957_out), .b(inst174_s), .co(inst141_co), .s(inst141_s));
  and inst1990 (inst1990_out, B[29], A[27]);
  OneBitAdder inst108 (.ci(inst107_co), .a(inst1990_out), .b(inst141_s), .co(inst108_co), .s(inst108_s));
  and inst2023 (inst2023_out, B[30], A[26]);
  nand inst2074 (inst2074_out, B[31], A[25]);
  OneBitAdder inst272 (.ci(inst271_co), .a(inst1794_out), .b(inst304_co), .co(inst272_co), .s(inst272_s));
  OneBitAdder inst239 (.ci(inst238_co), .a(inst1825_out), .b(inst272_s), .co(inst239_co), .s(inst239_s));
  OneBitAdder inst206 (.ci(inst205_co), .a(inst1892_out), .b(inst239_s), .co(inst206_co), .s(inst206_s));
  and inst1925 (inst1925_out, B[27], A[28]);
  OneBitAdder inst173 (.ci(inst172_co), .a(inst1925_out), .b(inst206_s), .co(inst173_co), .s(inst173_s));
  and inst1958 (inst1958_out, B[28], A[27]);
  OneBitAdder inst140 (.ci(inst139_co), .a(inst1958_out), .b(inst173_s), .co(inst140_co), .s(inst140_s));
  and inst1991 (inst1991_out, B[29], A[26]);
  OneBitAdder inst107 (.ci(inst106_co), .a(inst1991_out), .b(inst140_s), .co(inst107_co), .s(inst107_s));
  and inst2024 (inst2024_out, B[30], A[25]);
  OneBitAdder inst74 (.ci(inst73_co), .a(inst2024_out), .b(inst107_s), .co(inst74_co), .s(inst74_s));
  nand inst2073 (inst2073_out, B[31], A[24]);
  OneBitAdder inst42 (.ci(inst41_co), .a(inst2073_out), .b(inst74_s), .co(inst42_co), .s(Z[55]));
  nand inst1794 (inst1794_out, B[24], A[31]);
  and inst1825 (inst1825_out, B[25], A[30]);
  and inst1892 (inst1892_out, B[26], A[29]);
  OneBitAdder inst172 (.ci(inst171_co), .a(inst1926_out), .b(inst205_s), .co(inst172_co), .s(inst172_s));
  OneBitAdder inst139 (.ci(inst138_co), .a(inst1959_out), .b(inst172_s), .co(inst139_co), .s(inst139_s));
  OneBitAdder inst106 (.ci(inst105_co), .a(inst1992_out), .b(inst139_s), .co(inst106_co), .s(inst106_s));
  and inst2025 (inst2025_out, B[30], A[24]);
  OneBitAdder inst73 (.ci(inst72_co), .a(inst2025_out), .b(inst106_s), .co(inst73_co), .s(inst73_s));
  nand inst2072 (inst2072_out, B[31], A[23]);
  OneBitAdder inst41 (.ci(inst40_co), .a(inst2072_out), .b(inst73_s), .co(inst41_co), .s(Z[54]));
  nand inst1762 (inst1762_out, B[23], A[31]);
  OneBitAdder inst304 (.ci(inst303_co), .a(inst1762_out), .b(inst336_co), .co(inst304_co), .s(inst304_s));
  and inst1793 (inst1793_out, B[24], A[30]);
  OneBitAdder inst271 (.ci(inst270_co), .a(inst1793_out), .b(inst304_s), .co(inst271_co), .s(inst271_s));
  and inst1827 (inst1827_out, B[25], A[29]);
  OneBitAdder inst238 (.ci(inst237_co), .a(inst1827_out), .b(inst271_s), .co(inst238_co), .s(inst238_s));
  and inst1893 (inst1893_out, B[26], A[28]);
  OneBitAdder inst205 (.ci(inst204_co), .a(inst1893_out), .b(inst238_s), .co(inst205_co), .s(inst205_s));
  and inst1926 (inst1926_out, B[27], A[27]);
  and inst1959 (inst1959_out, B[28], A[26]);
  and inst1992 (inst1992_out, B[29], A[25]);
  OneBitAdder inst72 (.ci(inst71_co), .a(inst2026_out), .b(inst105_s), .co(inst72_co), .s(inst72_s));
  OneBitAdder inst40 (.ci(inst39_co), .a(inst2071_out), .b(inst72_s), .co(inst40_co), .s(Z[53]));
  OneBitAdder inst336 (.ci(inst335_co), .a(inst1730_out), .b(inst368_co), .co(inst336_co), .s(inst336_s));
  OneBitAdder inst303 (.ci(inst302_co), .a(inst1761_out), .b(inst336_s), .co(inst303_co), .s(inst303_s));
  OneBitAdder inst270 (.ci(inst269_co), .a(inst1795_out), .b(inst303_s), .co(inst270_co), .s(inst270_s));
  and inst1828 (inst1828_out, B[25], A[28]);
  OneBitAdder inst237 (.ci(inst236_co), .a(inst1828_out), .b(inst270_s), .co(inst237_co), .s(inst237_s));
  and inst1894 (inst1894_out, B[26], A[27]);
  OneBitAdder inst204 (.ci(inst203_co), .a(inst1894_out), .b(inst237_s), .co(inst204_co), .s(inst204_s));
  and inst1927 (inst1927_out, B[27], A[26]);
  OneBitAdder inst171 (.ci(inst170_co), .a(inst1927_out), .b(inst204_s), .co(inst171_co), .s(inst171_s));
  and inst1960 (inst1960_out, B[28], A[25]);
  OneBitAdder inst138 (.ci(inst137_co), .a(inst1960_out), .b(inst171_s), .co(inst138_co), .s(inst138_s));
  and inst1993 (inst1993_out, B[29], A[24]);
  OneBitAdder inst105 (.ci(inst104_co), .a(inst1993_out), .b(inst138_s), .co(inst105_co), .s(inst105_s));
  and inst2026 (inst2026_out, B[30], A[23]);
  nand inst2071 (inst2071_out, B[31], A[22]);
  nand inst1730 (inst1730_out, B[22], A[31]);
  and inst1761 (inst1761_out, B[23], A[30]);
  and inst1795 (inst1795_out, B[24], A[29]);
  OneBitAdder inst368 (.ci(inst367_co), .a(inst1698_out), .b(inst400_co), .co(inst368_co), .s(inst368_s));
  OneBitAdder inst236 (.ci(inst235_co), .a(inst1829_out), .b(inst269_s), .co(inst236_co), .s(inst236_s));
  OneBitAdder inst203 (.ci(inst202_co), .a(inst1895_out), .b(inst236_s), .co(inst203_co), .s(inst203_s));
  OneBitAdder inst170 (.ci(inst169_co), .a(inst1928_out), .b(inst203_s), .co(inst170_co), .s(inst170_s));
  OneBitAdder inst137 (.ci(inst136_co), .a(inst1961_out), .b(inst170_s), .co(inst137_co), .s(inst137_s));
  OneBitAdder inst104 (.ci(inst103_co), .a(inst1994_out), .b(inst137_s), .co(inst104_co), .s(inst104_s));
  and inst2027 (inst2027_out, B[30], A[22]);
  OneBitAdder inst71 (.ci(inst70_co), .a(inst2027_out), .b(inst104_s), .co(inst71_co), .s(inst71_s));
  nand inst2070 (inst2070_out, B[31], A[21]);
  OneBitAdder inst39 (.ci(inst38_co), .a(inst2070_out), .b(inst71_s), .co(inst39_co), .s(Z[52]));
  nand inst1698 (inst1698_out, B[21], A[31]);
  and inst1729 (inst1729_out, B[22], A[30]);
  OneBitAdder inst335 (.ci(inst334_co), .a(inst1729_out), .b(inst368_s), .co(inst335_co), .s(inst335_s));
  and inst1763 (inst1763_out, B[23], A[29]);
  OneBitAdder inst302 (.ci(inst301_co), .a(inst1763_out), .b(inst335_s), .co(inst302_co), .s(inst302_s));
  and inst1796 (inst1796_out, B[24], A[28]);
  OneBitAdder inst269 (.ci(inst268_co), .a(inst1796_out), .b(inst302_s), .co(inst269_co), .s(inst269_s));
  and inst1829 (inst1829_out, B[25], A[27]);
  and inst1895 (inst1895_out, B[26], A[26]);
  and inst1928 (inst1928_out, B[27], A[25]);
  and inst1961 (inst1961_out, B[28], A[24]);
  and inst1994 (inst1994_out, B[29], A[23]);
